# EAGLE design FPGA_board-v1 (EAGLE 9.1.3)
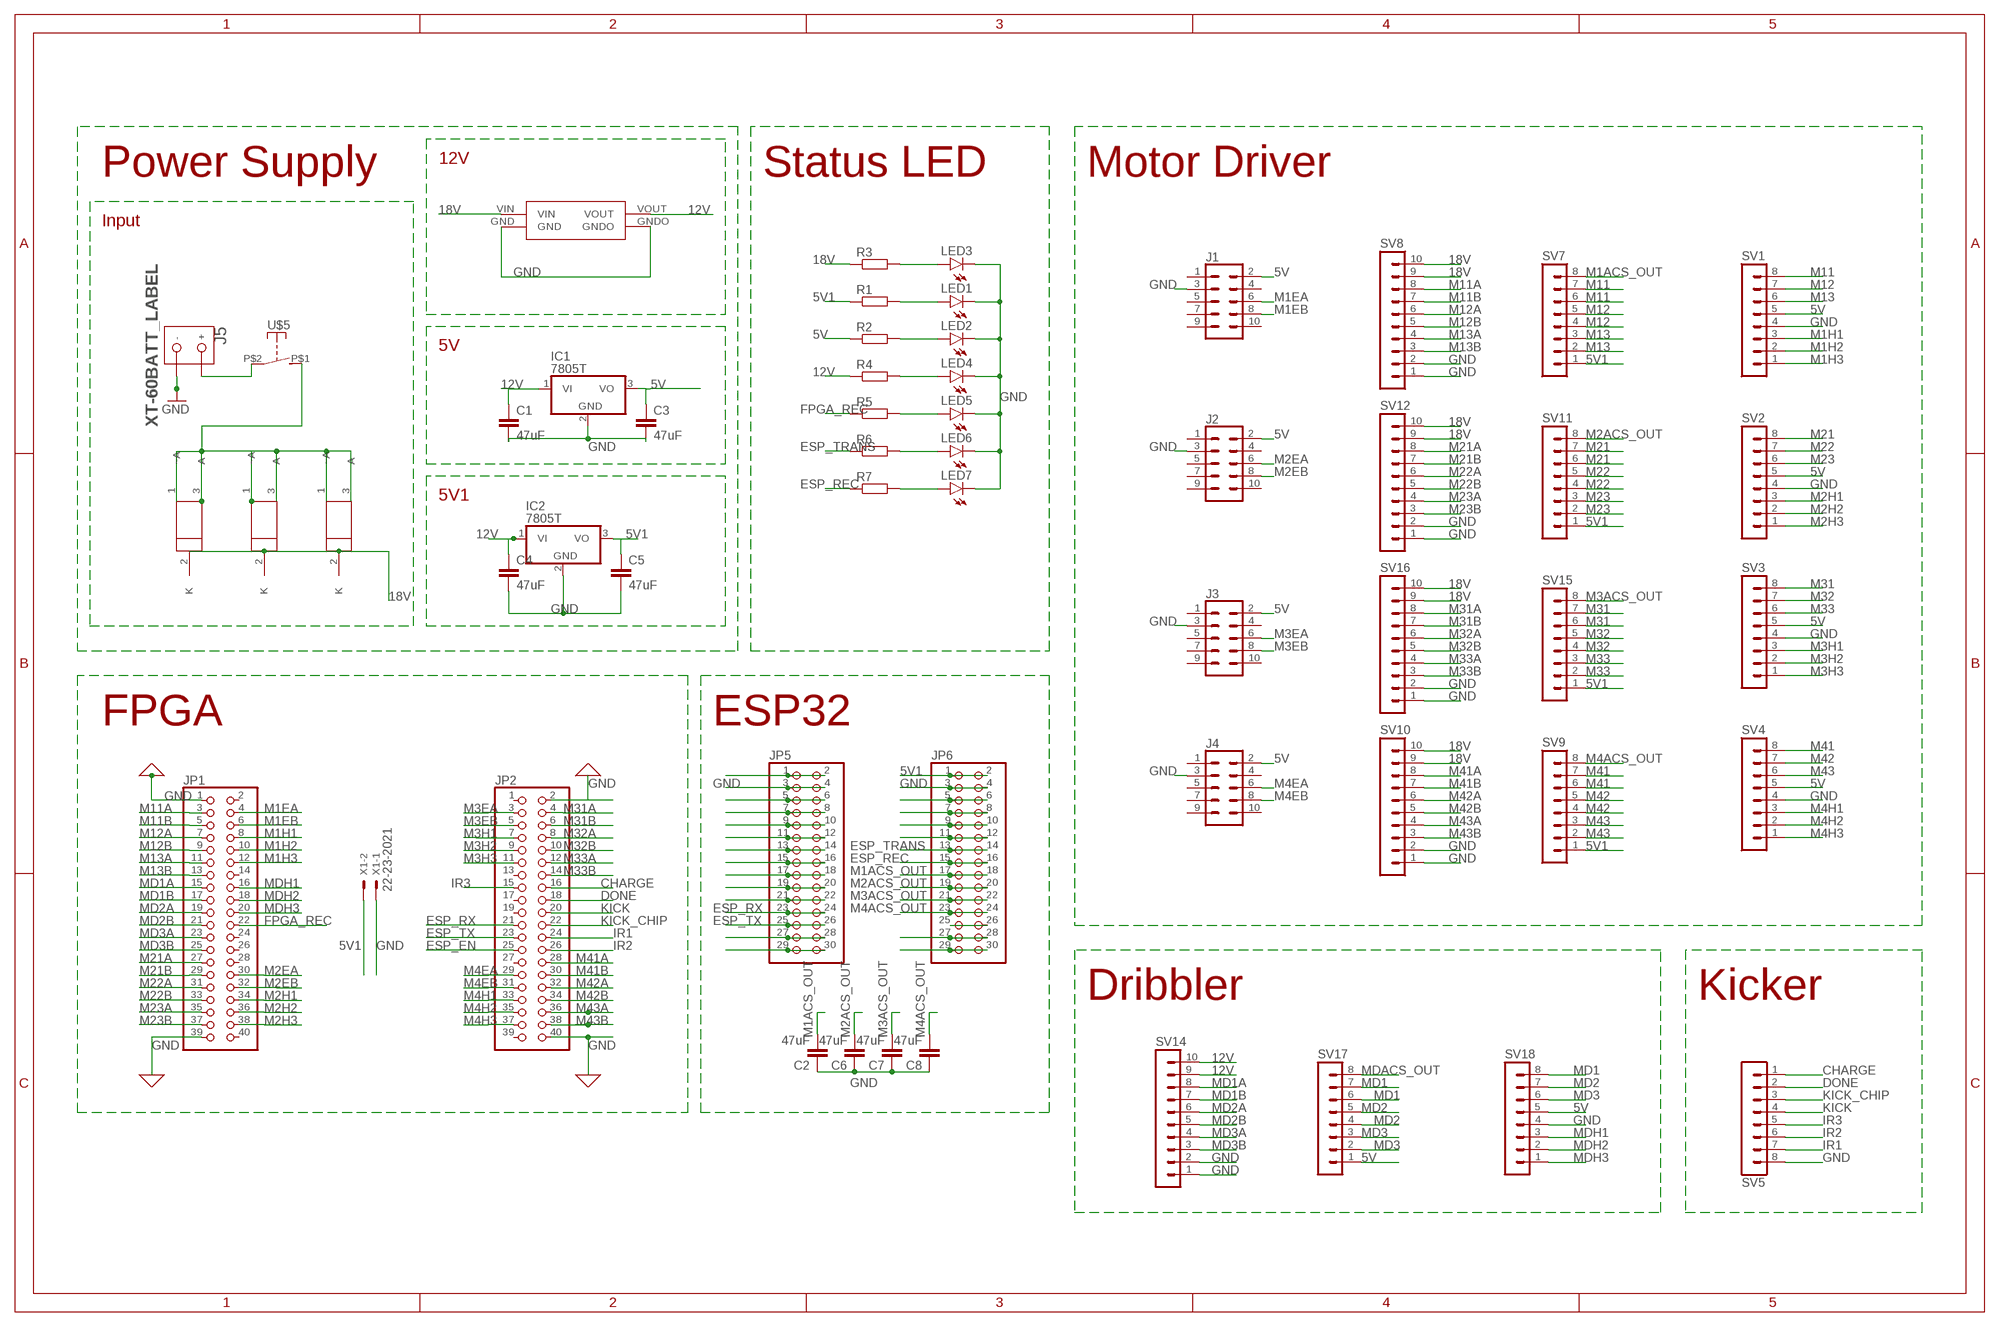
[diagram p0: schematic, sheet 1]

## Parts
C1  47uF  C-EUC1206  [C1206]
C2  47uF  C-EUC1206  [C1206]
C3  47uF  C-EUC1206  [C1206]
C4  47uF  C-EUC1206  [C1206]
C5  47uF  C-EUC1206  [C1206]
C6  47uF  C-EUC1206  [C1206]
C7  47uF  C-EUC1206  [C1206]
C8  47uF  C-EUC1206  [C1206]
IC1  7805T  [TO220H]
IC2  7805T  [TO220H]
J1  CONN_05X2SHD_LOCK  [2X5-SHROUDED_LOCK]
J2  CONN_05X2SHD_LOCK  [2X5-SHROUDED_LOCK]
J3  CONN_05X2SHD_LOCK  [2X5-SHROUDED_LOCK]
J4  CONN_05X2SHD_LOCK  [2X5-SHROUDED_LOCK]
J5  XT-60BATT_LABEL  [XT-60]
JP1  PINHD-2X20  [2X20]
JP2  PINHD-2X20  [2X20]
JP5  PINHD-2X15  [2X15]
JP6  PINHD-2X15  [2X15]
LED1  LEDSMT1206  [1206]
LED2  LEDSMT1206  [1206]
LED3  LEDSMT1206  [1206]
LED4  LEDSMT1206  [1206]
LED5  LEDSMT1206  [1206]
LED6  LEDSMT1206  [1206]
LED7  LEDSMT1206  [1206]
R1  R-EU_R1206  [R1206]
R2  R-EU_R1206  [R1206]
R3  R-EU_R1206  [R1206]
R4  R-EU_R1206  [R1206]
R5  R-EU_R1206  [R1206]
R6  R-EU_R1206  [R1206]
R7  R-EU_R1206  [R1206]
SV1  MA08-1  [MA08-1]
SV2  MA08-1  [MA08-1]
SV3  MA08-1  [MA08-1]
SV4  MA08-1  [MA08-1]
SV5  MA08-1  [MA08-1]
SV7  MA08-1  [MA08-1]
SV8  MA10-1  [MA10-1]
SV9  MA08-1  [MA08-1]
SV10  MA10-1  [MA10-1]
SV11  MA08-1  [MA08-1]
SV12  MA10-1  [MA10-1]
SV14  MA10-1  [MA10-1]
SV15  MA08-1  [MA08-1]
SV16  MA10-1  [MA10-1]
SV17  MA08-1  [MA08-1]
SV18  MA08-1  [MA08-1]
U1  LP38690DT-3.3  [TO228P1042X238-3N]
U2  LP38690DT-3.3  [TO228P1042X238-3N]
U3  LP38690DT-3.3  [TO228P1042X238-3N]
U$4  BUCK  [BUCK]
U$5  SWITCH_DA10  [DA10]
X1  22-23-2021  [22-23-2021]

## Nets
5V [5v]: C3.1 IC1.3(VO) J1.2 J2.2 J3.2 J4.2 R2.1 SV1.5 SV2.5 SV3.5 SV4.5 SV17.1 SV18.5
5V1 [5v]: C5.1 IC2.3(VO) JP6.1 JP6.2 R1.1 SV7.1 SV9.1 SV11.1 SV15.1 X1.2
12V [18V]: C1.1 C4.1 IC1.1(VI) IC2.1(VI) R4.1 SV14.9 SV14.10 U$4.VOUT
18V [18V]: R3.1 SV8.9 SV8.10 SV10.9 SV10.10 SV12.9 SV12.10 SV16.9 SV16.10 U1.2(K) U2.2(K) U3.2(K) U$4.VIN
CHARGE: JP2.16 SV5.1
DONE: JP2.18 SV5.2
ESP_EN: JP2.25
ESP_REC: JP6.15 JP6.16 R7.1
ESP_RX: JP2.21 JP5.23 JP5.24
ESP_TRANS: JP6.13 JP6.14 R6.1
ESP_TX: JP2.23 JP5.25 JP5.26
FPGA_REC: JP1.22 R5.1
GND [gnd]: C1.2 C2.1 C3.2 C4.2 C5.2 C6.1 C7.1 C8.1 IC1.2(GND) IC2.2(GND) J1.3 J2.3 J3.3 J4.3 J5.GND(-) JP1.1 JP1.39 JP2.2 JP2.40 JP5.3 JP5.4 JP6.3 JP6.4 LED1.C LED2.C LED3.C LED4.C LED5.C LED6.C LED7.C SV1.4 SV2.4 SV3.4 SV4.4 SV5.8 SV8.1 SV8.2 SV10.1 SV10.2 SV12.1 SV12.2 SV14.1 SV14.2 SV16.1 SV16.2 SV18.4 U$4.GND U$4.GNDO X1.1
INPUT [VCKT]: U1.1(~A) U1.3(A) U2.1(~A) U2.3(A) U3.1(~A) U3.3(A) U$5.P$1(S)
IR1: JP2.24 SV5.7
IR2: JP2.26 SV5.6
IR3 [signal]: JP2.15 SV5.5
KICK: JP2.20 SV5.4
KICK_CHIP: JP2.22 SV5.3
M1ACS_OUT: C2.2 JP6.17 JP6.18 SV7.8
M1EA: J1.6 JP1.4
M1EB: J1.8 JP1.6
M1H1: JP1.8 SV1.3
M1H2: JP1.10 SV1.2
M1H3: JP1.12 SV1.1
M2ACS_OUT: C6.2 JP6.19 JP6.20 SV11.8
M2EA: J2.6 JP1.30
M2EB: J2.8 JP1.32
M2H1: JP1.34 SV2.3
M2H2: JP1.36 SV2.2
M2H3: JP1.38 SV2.1
M3ACS_OUT: C7.2 JP6.21 JP6.22 SV15.8
M3EA: J3.6 JP2.3
M3EB: J3.8 JP2.5
M3H1: JP2.7 SV3.3
M3H2: JP2.9 SV3.2
M3H3: JP2.11 SV3.1
M4ACS_OUT: C8.2 JP6.23 JP6.24 SV9.8
M4EA: J4.6 JP2.29
M4EB: J4.8 JP2.31
M4H1: JP2.33 SV4.3
M4H2: JP2.35 SV4.2
M4H3: JP2.37 SV4.1
M11 [motor]: SV1.8 SV7.6 SV7.7
M11A [signal]: JP1.3 SV8.8
M11B [signal]: JP1.5 SV8.7
M12 [motor]: SV1.7 SV7.4 SV7.5
M12A: JP1.7 SV8.6
M12B: JP1.9 SV8.5
M13 [motor]: SV1.6 SV7.2 SV7.3
M13A: JP1.11 SV8.4
M13B: JP1.13 SV8.3
M21 [motor]: SV2.8 SV11.6 SV11.7
M21A: JP1.27 SV12.8
M21B: JP1.29 SV12.7
M22 [motor]: SV2.7 SV11.4 SV11.5
M22A: JP1.31 SV12.6
M22B: JP1.33 SV12.5
M23 [motor]: SV2.6 SV11.2 SV11.3
M23A: JP1.35 SV12.4
M23B: JP1.37 SV12.3
M31 [motor]: SV3.8 SV15.6 SV15.7
M31A: JP2.4 SV16.8
M31B: JP2.6 SV16.7
M32 [motor]: SV3.7 SV15.4 SV15.5
M32A: JP2.8 SV16.6
M32B: JP2.10 SV16.5
M33 [motor]: SV3.6 SV15.2 SV15.3
M33A: JP2.12 SV16.4
M33B: JP2.14 SV16.3
M41 [motor]: SV4.8 SV9.6 SV9.7
M41A: JP2.28 SV10.8
M41B: JP2.30 SV10.7
M42 [motor]: SV4.7 SV9.4 SV9.5
M42A: JP2.32 SV10.6
M42B: JP2.34 SV10.5
M43 [motor]: SV4.6 SV9.2 SV9.3
M43A: JP2.36 SV10.4
M43B: JP2.38 SV10.3
MD1 [motor]: SV17.6 SV17.7 SV18.8
MD1A: JP1.15 SV14.8
MD1B: JP1.17 SV14.7
MD2 [motor]: SV17.4 SV17.5 SV18.7
MD2A: JP1.19 SV14.6
MD2B: JP1.21 SV14.5
MD3 [motor]: SV17.2 SV17.3 SV18.6
MD3A: JP1.23 SV14.4
MD3B: JP1.25 SV14.3
MDACS_OUT: SV17.8
MDH1: JP1.16 SV18.3
MDH2: JP1.18 SV18.2
MDH3: JP1.20 SV18.1
N$1: JP5.1 JP5.2
N$4: LED1.A R1.2
N$6: JP5.5 JP5.6
N$7: LED2.A R2.2
N$8: JP5.7 JP5.8
N$9: JP5.9 JP5.10
N$10: LED3.A R3.2
N$11: JP5.11 JP5.12
N$12: JP5.13 JP5.14
N$13: LED4.A R4.2
N$14: JP5.15 JP5.16
N$15: JP5.17 JP5.18
N$16: LED5.A R5.2
N$17: JP5.19 JP5.20
N$18: JP5.21 JP5.22
N$19: LED6.A R6.2
N$22: LED7.A R7.2
N$23: JP5.27 JP5.28
N$24: JP5.29 JP5.30
N$27: JP6.5 JP6.6
N$28: JP6.7 JP6.8
N$29: JP6.9 JP6.10
N$30: JP6.11 JP6.12
N$38: JP6.27 JP6.28
N$39: JP6.29 JP6.30
N$41: JP6.25 JP6.26
SUPP [VCKT]: J5.BATT(+) U$5.P$2(P)
Unconnected: J1.1 J1.4 J1.5 J1.7 J1.9 J1.10 J2.1 J2.4 J2.5 J2.7 J2.9 J2.10 J3.1 J3.4 J3.5 J3.7 J3.9 J3.10 J4.1 J4.4 J4.5 J4.7 J4.9 J4.10 JP1.2 JP1.14 JP1.24 JP1.26 JP1.28 JP1.40 JP2.1 JP2.13 JP2.17 JP2.19 JP2.27 JP2.39

## Notes on the sheet
- 12V
- Power Supply | Status LED | Motor Driver
- Input
- 5V
- 5V1
- FPGA | ESP32
- Dribbler | Kicker

## Library data of the parts
C1-C8 = rcl:C-EU: CAPACITOR, European symbol
IC1 IC2 = linear:78*: Positive VOLTAGE REGULATOR Source: http://cache.national.com/ds/LM/LM78L05.pdf http://www.fairchildsemi.com/ds/LM/LM7805.pdf
J1-J4 = SparkFun-Connectors:CONN_05X2: Multi connection point. Often used as Generic Header-pin footprint for 0.1 inch spaced/style header connections For AVR SPI programming port, see special device with nice symbol: "AVR_SPI_PROG_5x2.dev" You can populate with any combo of single row headers, but if you'd like an exact match, check these: 2x5 AVR ICSP Male Header <https://www.sparkfun.com/products/778> (PRT-00778) 2x5 Pin Shrouded Header <https://www.sparkfun.com/products/8506> (PRT-08506) On any of the 0.1 inch spaced packages, you can populate with these: Break Away Headers - Straight <https://www.sparkfun.com/products/116> (PRT-00116) Break Away Male Headers - Right Angle <https://www.sparkfun.com/products/553> (PRT-00553) Female Headers <https://www.sparkfun.com/products/115> (PRT-00115) Break Away Headers - Machine Pin <https://www.sparkfun.com/products/117> (PRT-00117) Break Away Female Headers - Swiss Machine Pin <https://www.sparkfun.com/products/743> (PRT-00743) Special note: the shrouded connector mates well with our 5x2 ribbon cables: 2x5 Pin IDC Ribbon Cable <https://www.sparkfun.com/products/8535> (PRT-08535); PROD_ID: CONN-08671; SF_ID: PRT-08506
J5 = RoboJackets-Connectors:XT-60: XT-60 Power Connector Distributor: HobbyKing <http://www.hobbyking.com/hobbyking/store/RC_PRODUCT_SEARCH.asp?strSearch=xt-60>
JP1 JP2 = pinhead:PINHD-2X20: PIN HEADER
JP5 JP6 = pinhead:PINHD-2X15: PIN HEADER
LED1-LED7 = led:LED: LED OSRAM: - CHIPLED LG R971, LG N971, LY N971, LG Q971, LY Q971, LO R971, LY R971 LH N974, LH R974 LS Q976, LO Q976, LY Q976 LO Q996 - Hyper CHIPLED LW Q18S LB Q993, LB Q99A, LB R99A - SideLED LS A670, LO A670, LY A670, LG A670, LP A670 LB A673, LV A673, LT A673, LW A673 LH A674 LY A675 LS A676, LA A676, LO A676, LY A676, LW A676 LS A679, LY A679, LG A679 - Hyper Micro SIDELED® LS Y876, LA Y876, LO Y876, LY Y876 LT Y87S - SmartLED LW L88C, LW L88S LB L89C, LB L89S, LG L890 LS L89K, LO L89K, LY L89K LS L896, LA L896, LO L896, LY L896 - TOPLED LS T670, LO T670, LY T670, LG T670, LP T670 LSG T670, LSP T670, LSY T670, LOP T670, LYG T670 LG T671, LOG T671, LSG T671 LB T673, LV T673, LT T673, LW T673 LH T674 LS T676, LA T676, LO T676, LY T676, LB T676, LH T676, LSB T676, LW T676 LB T67C, LV T67C, LT T67C, LS T67K, LO T67K, LY T67K, LW E67C LS E67B, LA E67B, LO E67B, LY E67B, LB E67C, LV E67C, LT E67C LW T67C LS T679, LY T679, LG T679 LS T770, LO T770, LY T770, LG T770, LP T770 LB T773, LV T773, LT T773, LW T773 LH T774 LS E675, LA E675, LY E675, LS T675 LS T776, LA T776, LO T776, LY T776, LB T776 LHGB T686 LT T68C, LB T68C - Hyper Mini TOPLED® LB M676 - Mini TOPLED Santana® LG M470 LS M47K, LO M47K, LY M47K Source: http://www.osram.convergy.de LUXEON: - LUMILED® LXK2-PW12-R00, LXK2-PW12-S00, LXK2-PW14-U00, LXK2-PW14-V00 LXK2-PM12-R00, LXK2-PM12-S00, LXK2-PM14-U00 LXK2-PE12-Q00, LXK2-PE12-R00, LXK2-PE12-S00, LXK2-PE14-T00, LXK2-PE14-U00 LXK2-PB12-K00, LXK2-PB12-L00, LXK2-PB12-M00, LXK2-PB14-N00, LXK2-PB14-P00, LXK2-PB14-Q00 LXK2-PR12-L00, LXK2-PR12-M00, LXK2-PR14-Q00, LXK2-PR14-R00 LXK2-PD12-Q00, LXK2-PD12-R00, LXK2-PD12-S00 LXK2-PH12-R00, LXK2-PH12-S00 LXK2-PL12-P00, LXK2-PL12-Q00, LXK2-PL12-R00 Source: www.luxeon.com KINGBRIGHT: KA-3528ASYC Source: www.kingbright.com
R1-R7 = resistor:R-EU_: RESISTOR, European symbol
SV1-SV5 SV7 SV9 SV11 SV15 SV17 SV18 = con-lstb:MA08-1: PIN HEADER; OC_FARNELL: unknown; OC_NEWARK: unknown
SV8 SV10 SV12 SV14 SV16 = con-lstb:MA10-1: PIN HEADER; OC_FARNELL: unknown; OC_NEWARK: unknown
U1-U3 = LP38690DT-3.3:LP38690DT-3.3; MPN: LP38690DT-3.3; OC_FARNELL: 1008048; OC_NEWARK: 41K7439; PACKAGE: TO-252; SUPPLIER: National Semiconductor
U$4 = BUCK:BUCK
U$5 = switch_DA10:SWITCH_DA10
X1 = con-molex:22-23-2021: .100" (2.54mm) Center Header - 2 Pin; MF: MOLEX; MPN: 22-23-2021; OC_FARNELL: 1462926; OC_NEWARK: 25C3832

## Net classes
0 signal1: width 0.3 mm, drill 0.4 mm, clearance 0.2 mm
1 5v: width 0.4 mm, drill 0.4 mm, clearance 0.2 mm
2 18V: width 1.2 mm, drill 1.3 mm, clearance 0.2 mm
3 signal: width 0.3 mm, drill 0.4 mm, clearance 0.2 mm
4 gnd: width 0.3 mm, drill 0.4 mm, clearance 0.2 mm
5 VCKT: width 4 mm, drill 4 mm, clearance 0.2 mm
6 motor: width 0.8 mm, drill 1 mm, clearance 0.2 mm

## Board
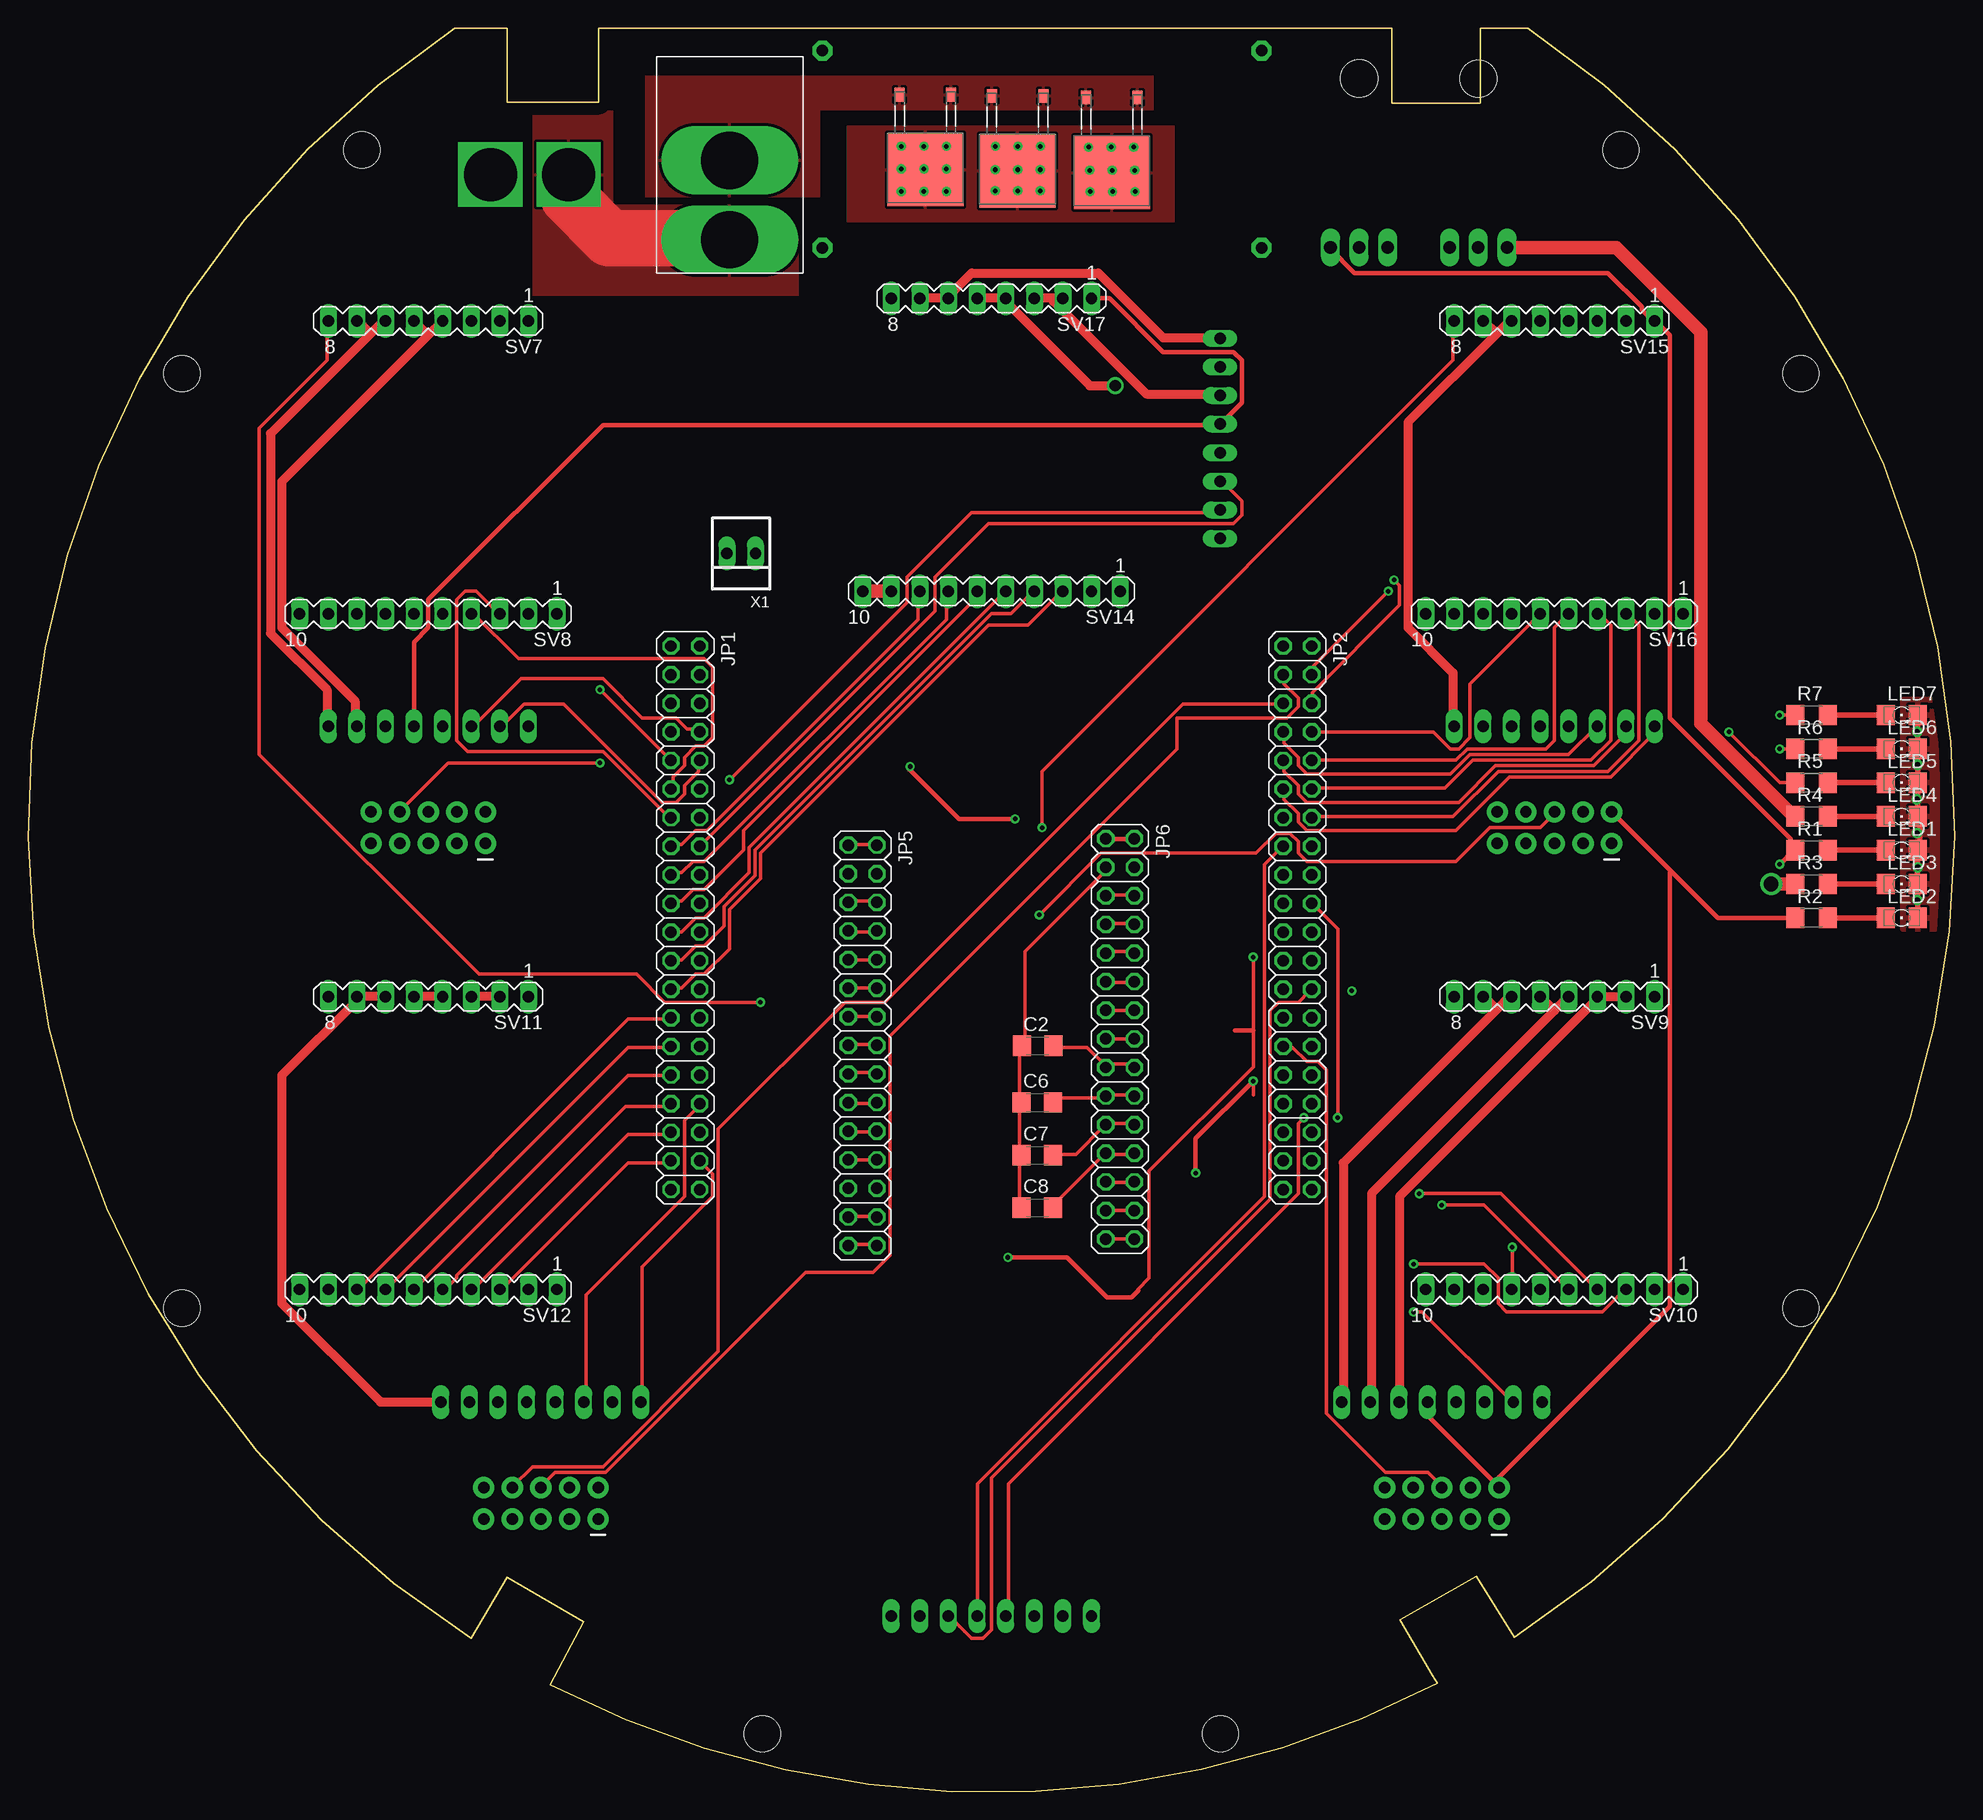
[diagram p1: board, top side]
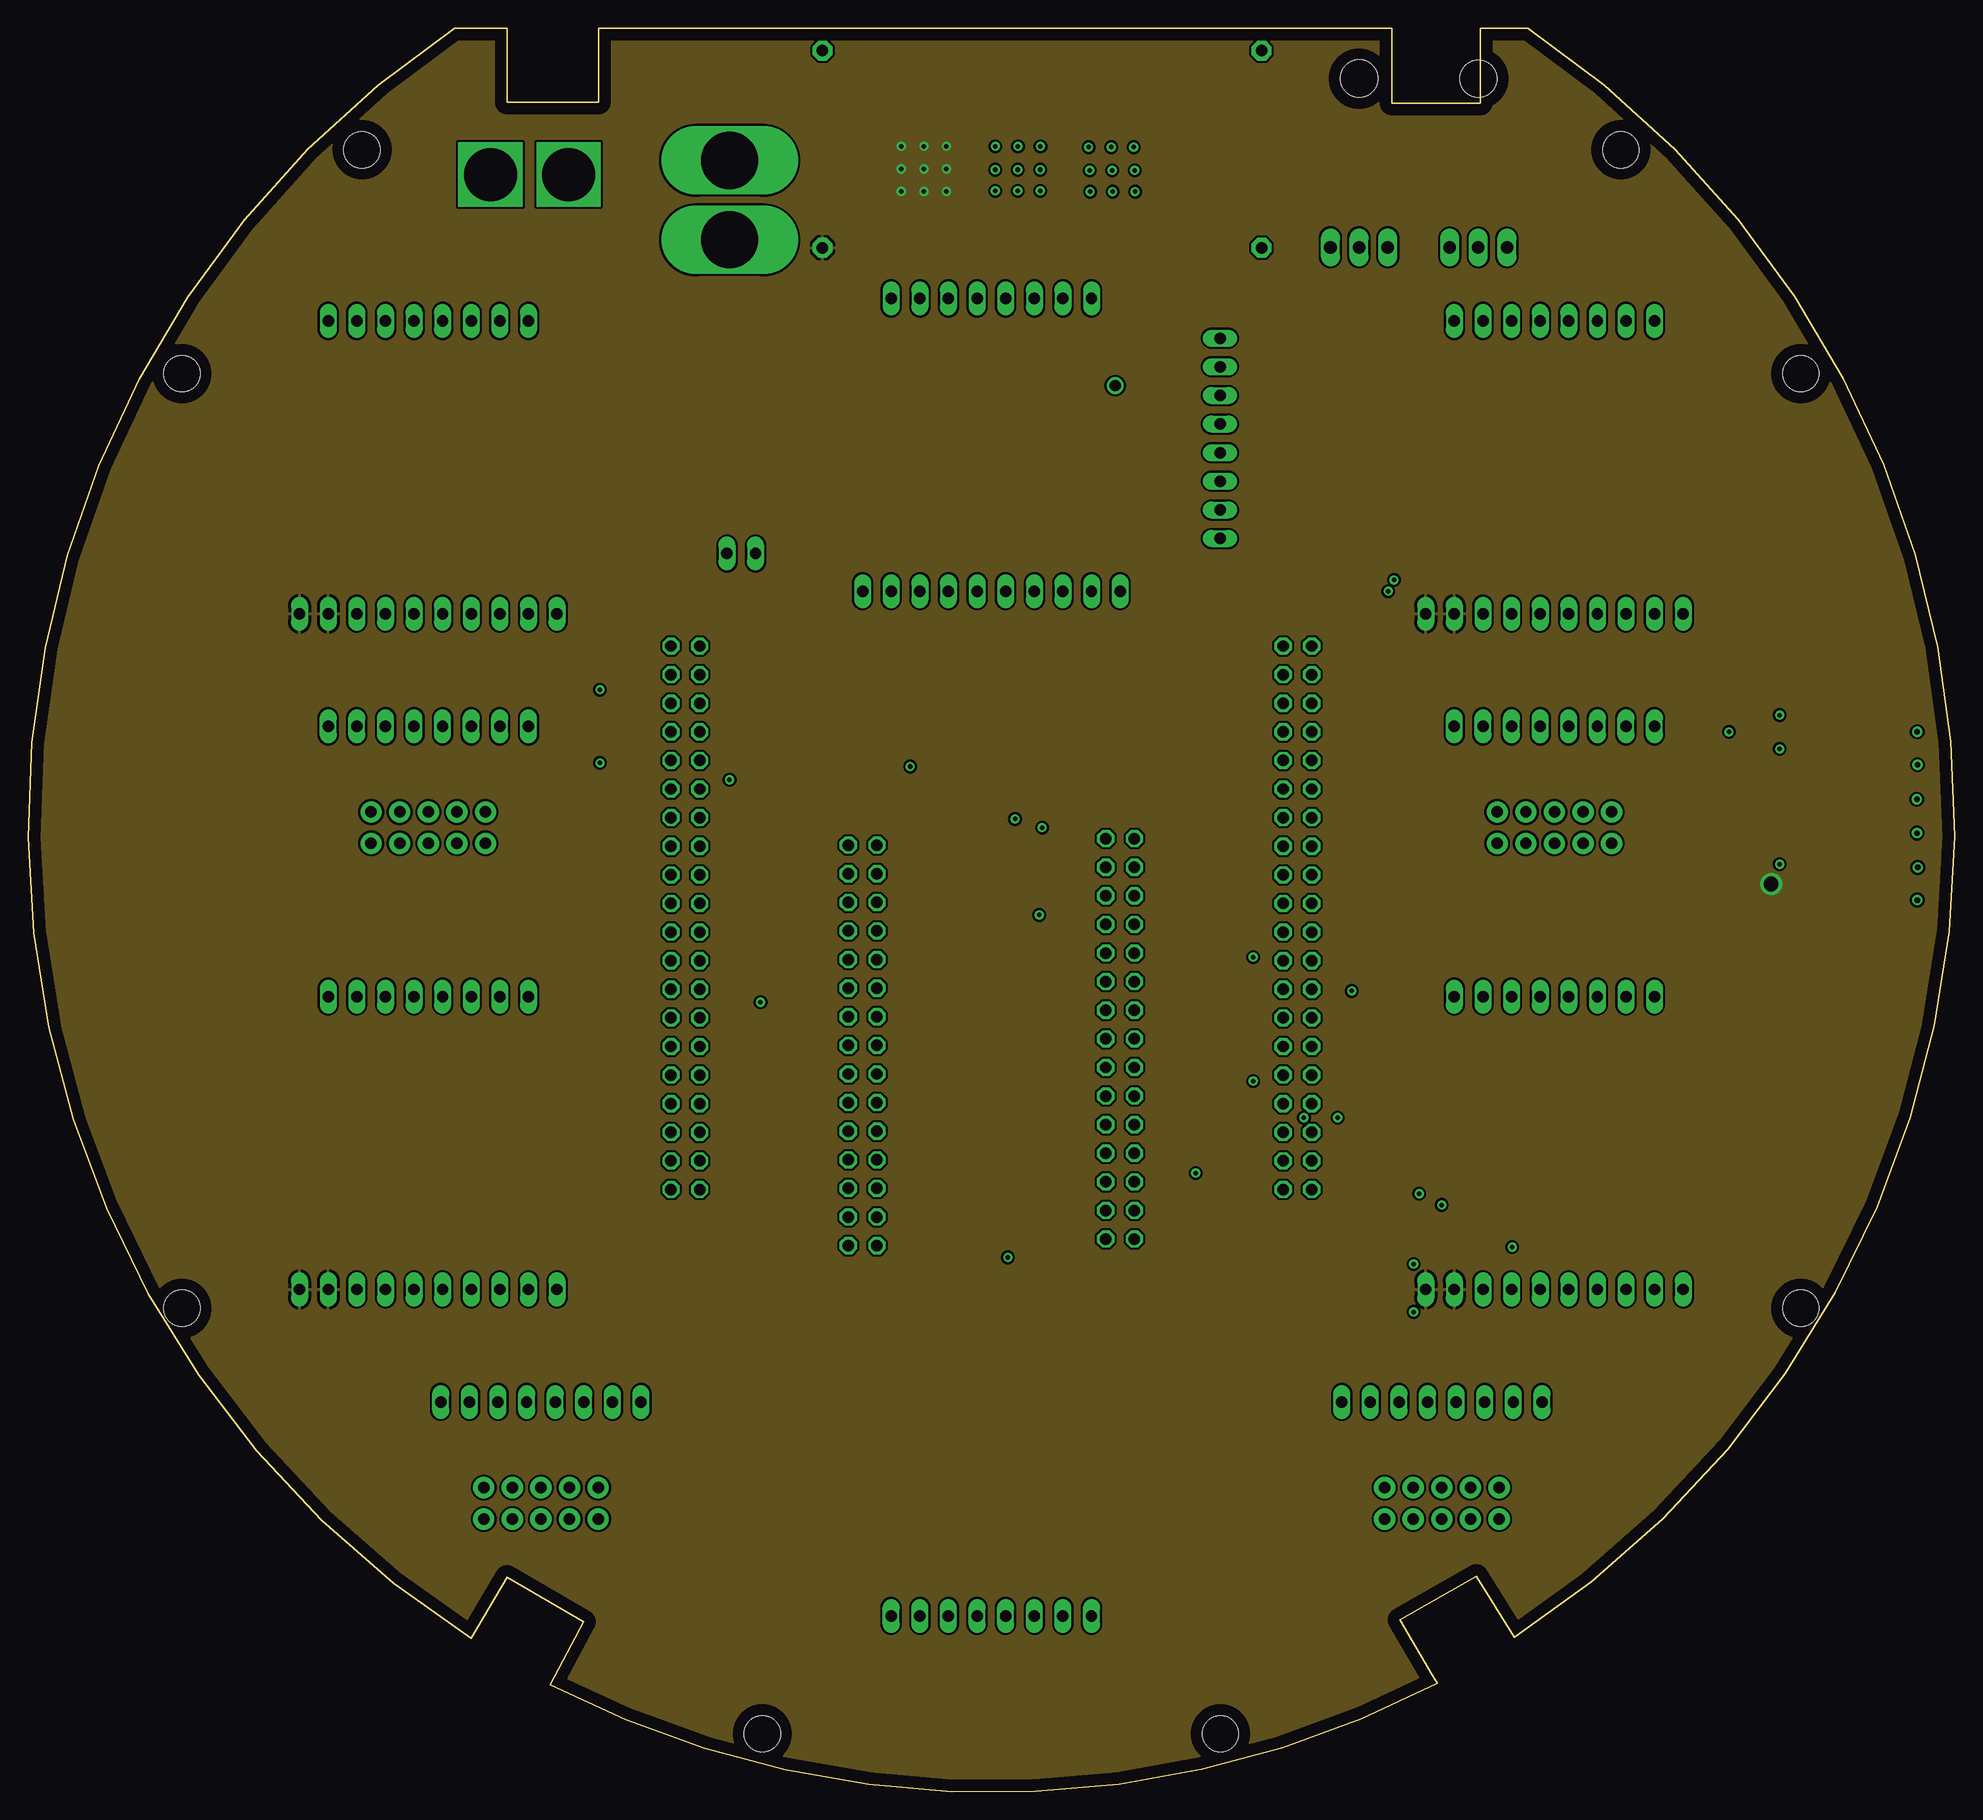
[diagram p2: board, inner layer Route2]
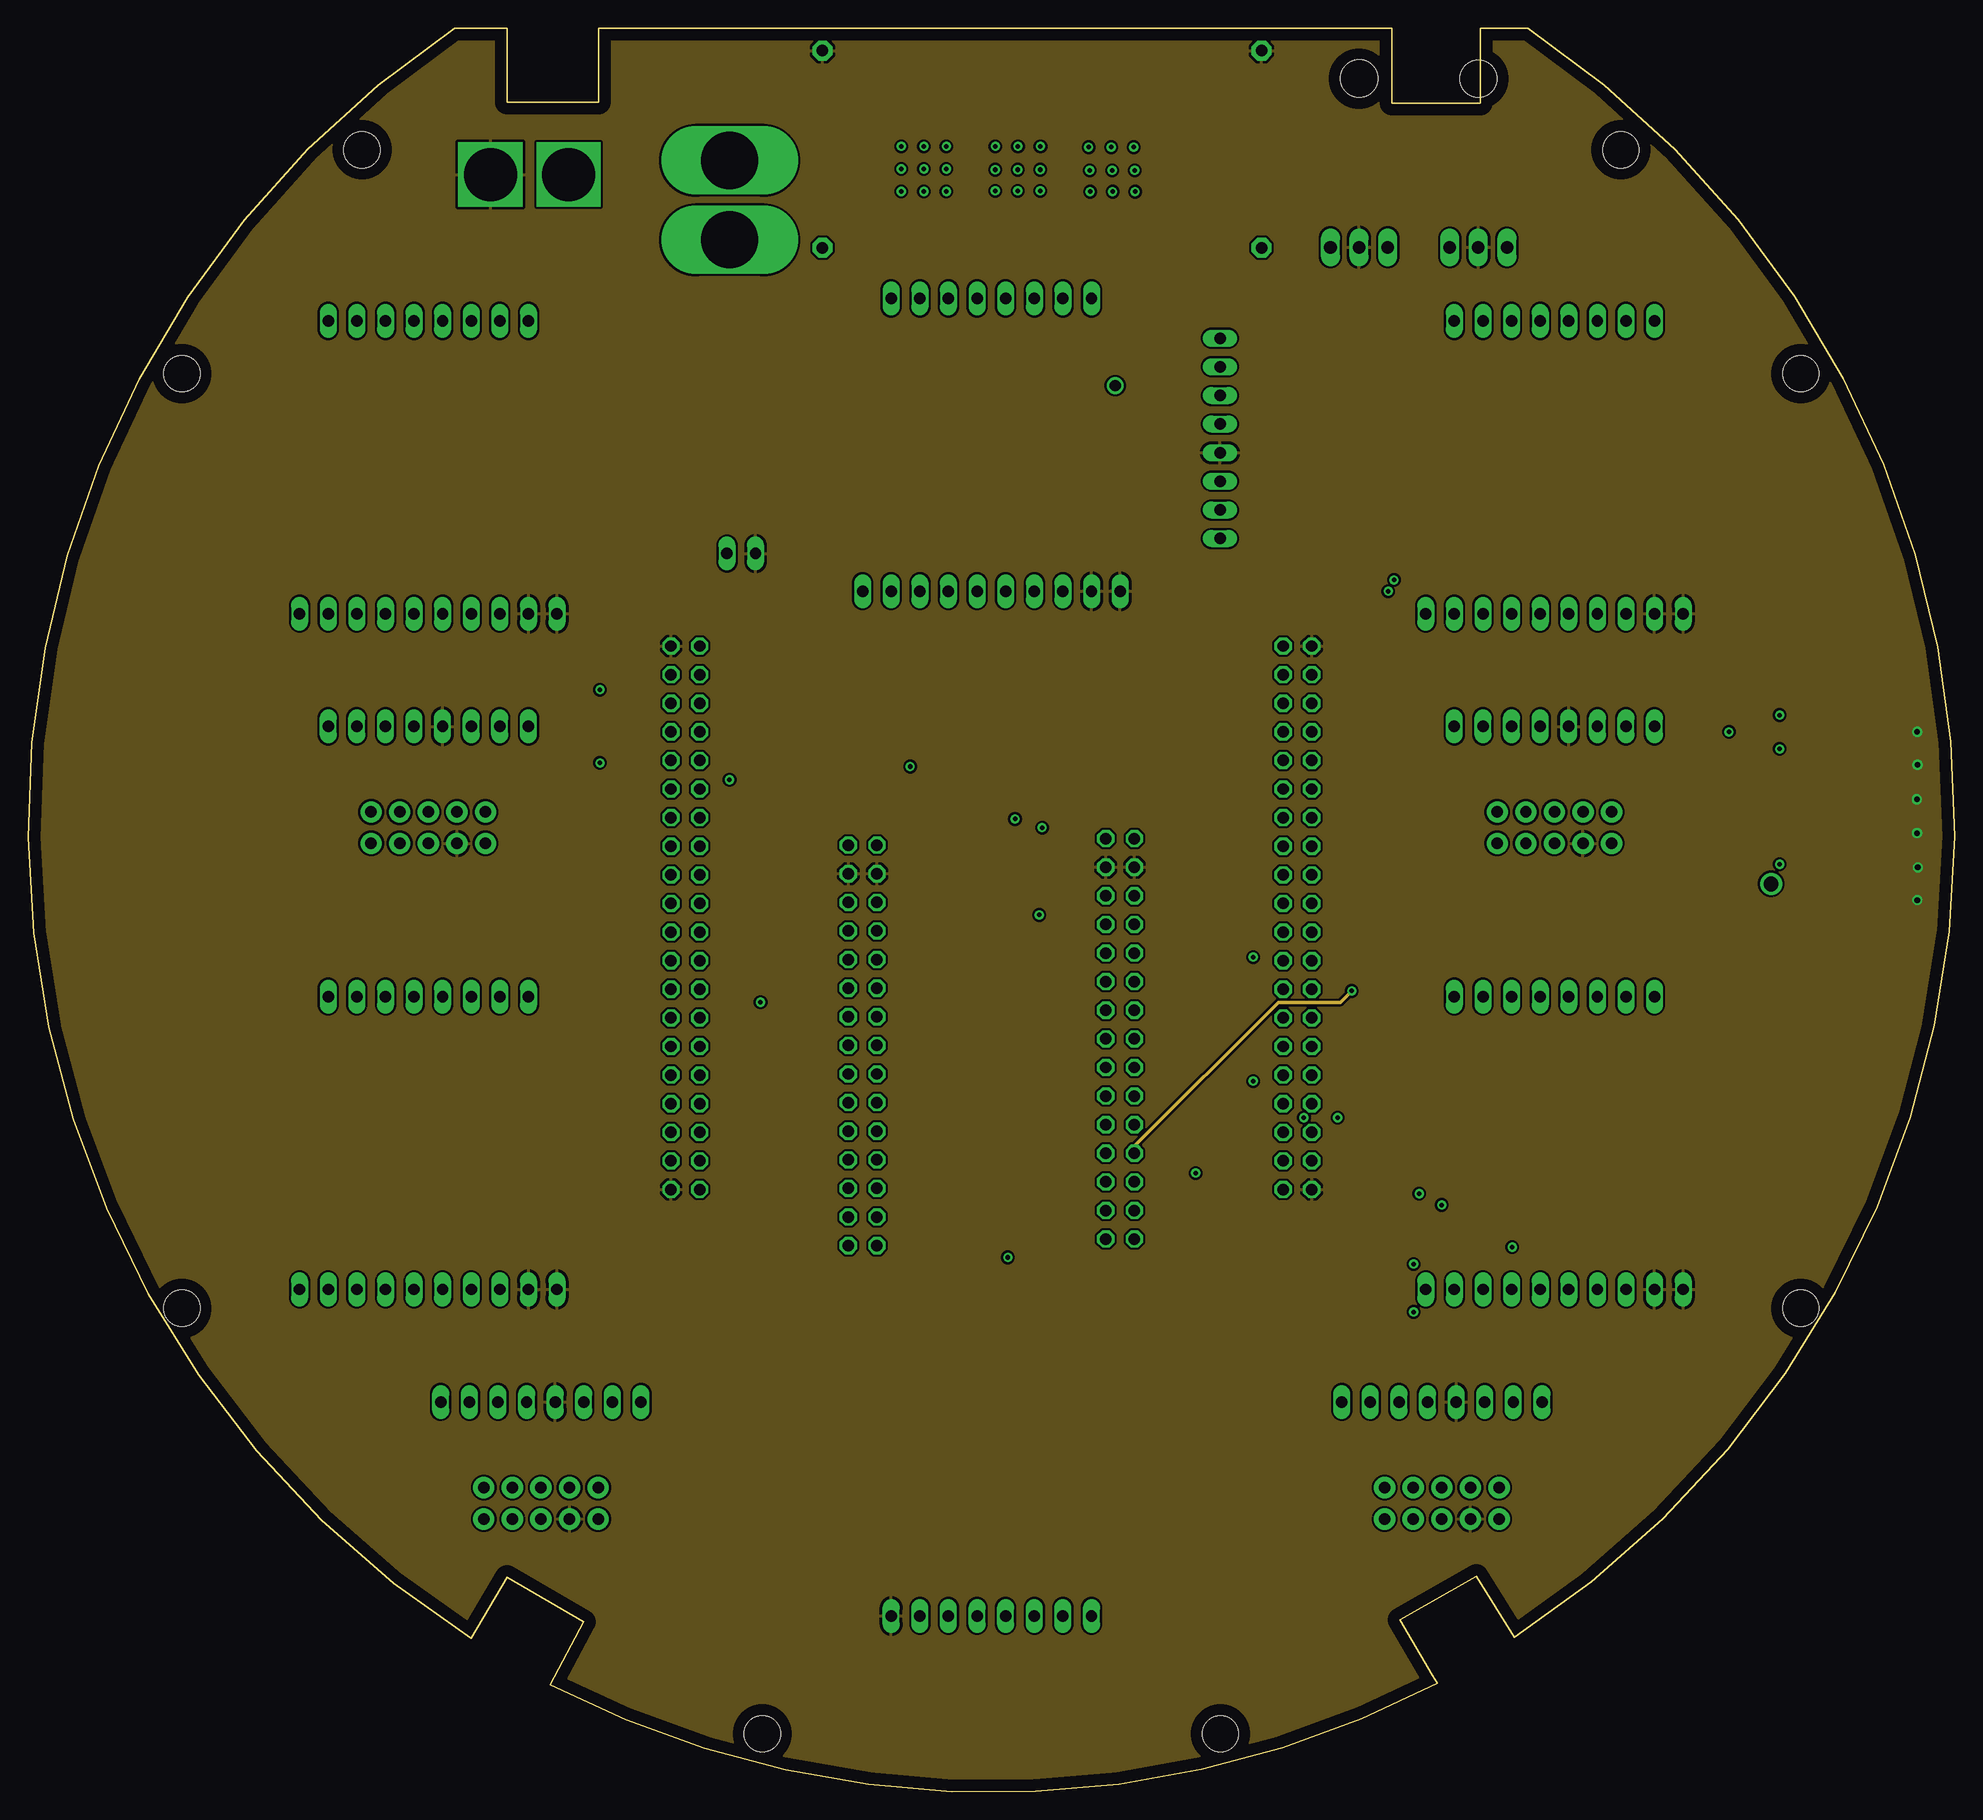
[diagram p3: board, inner layer Route15]
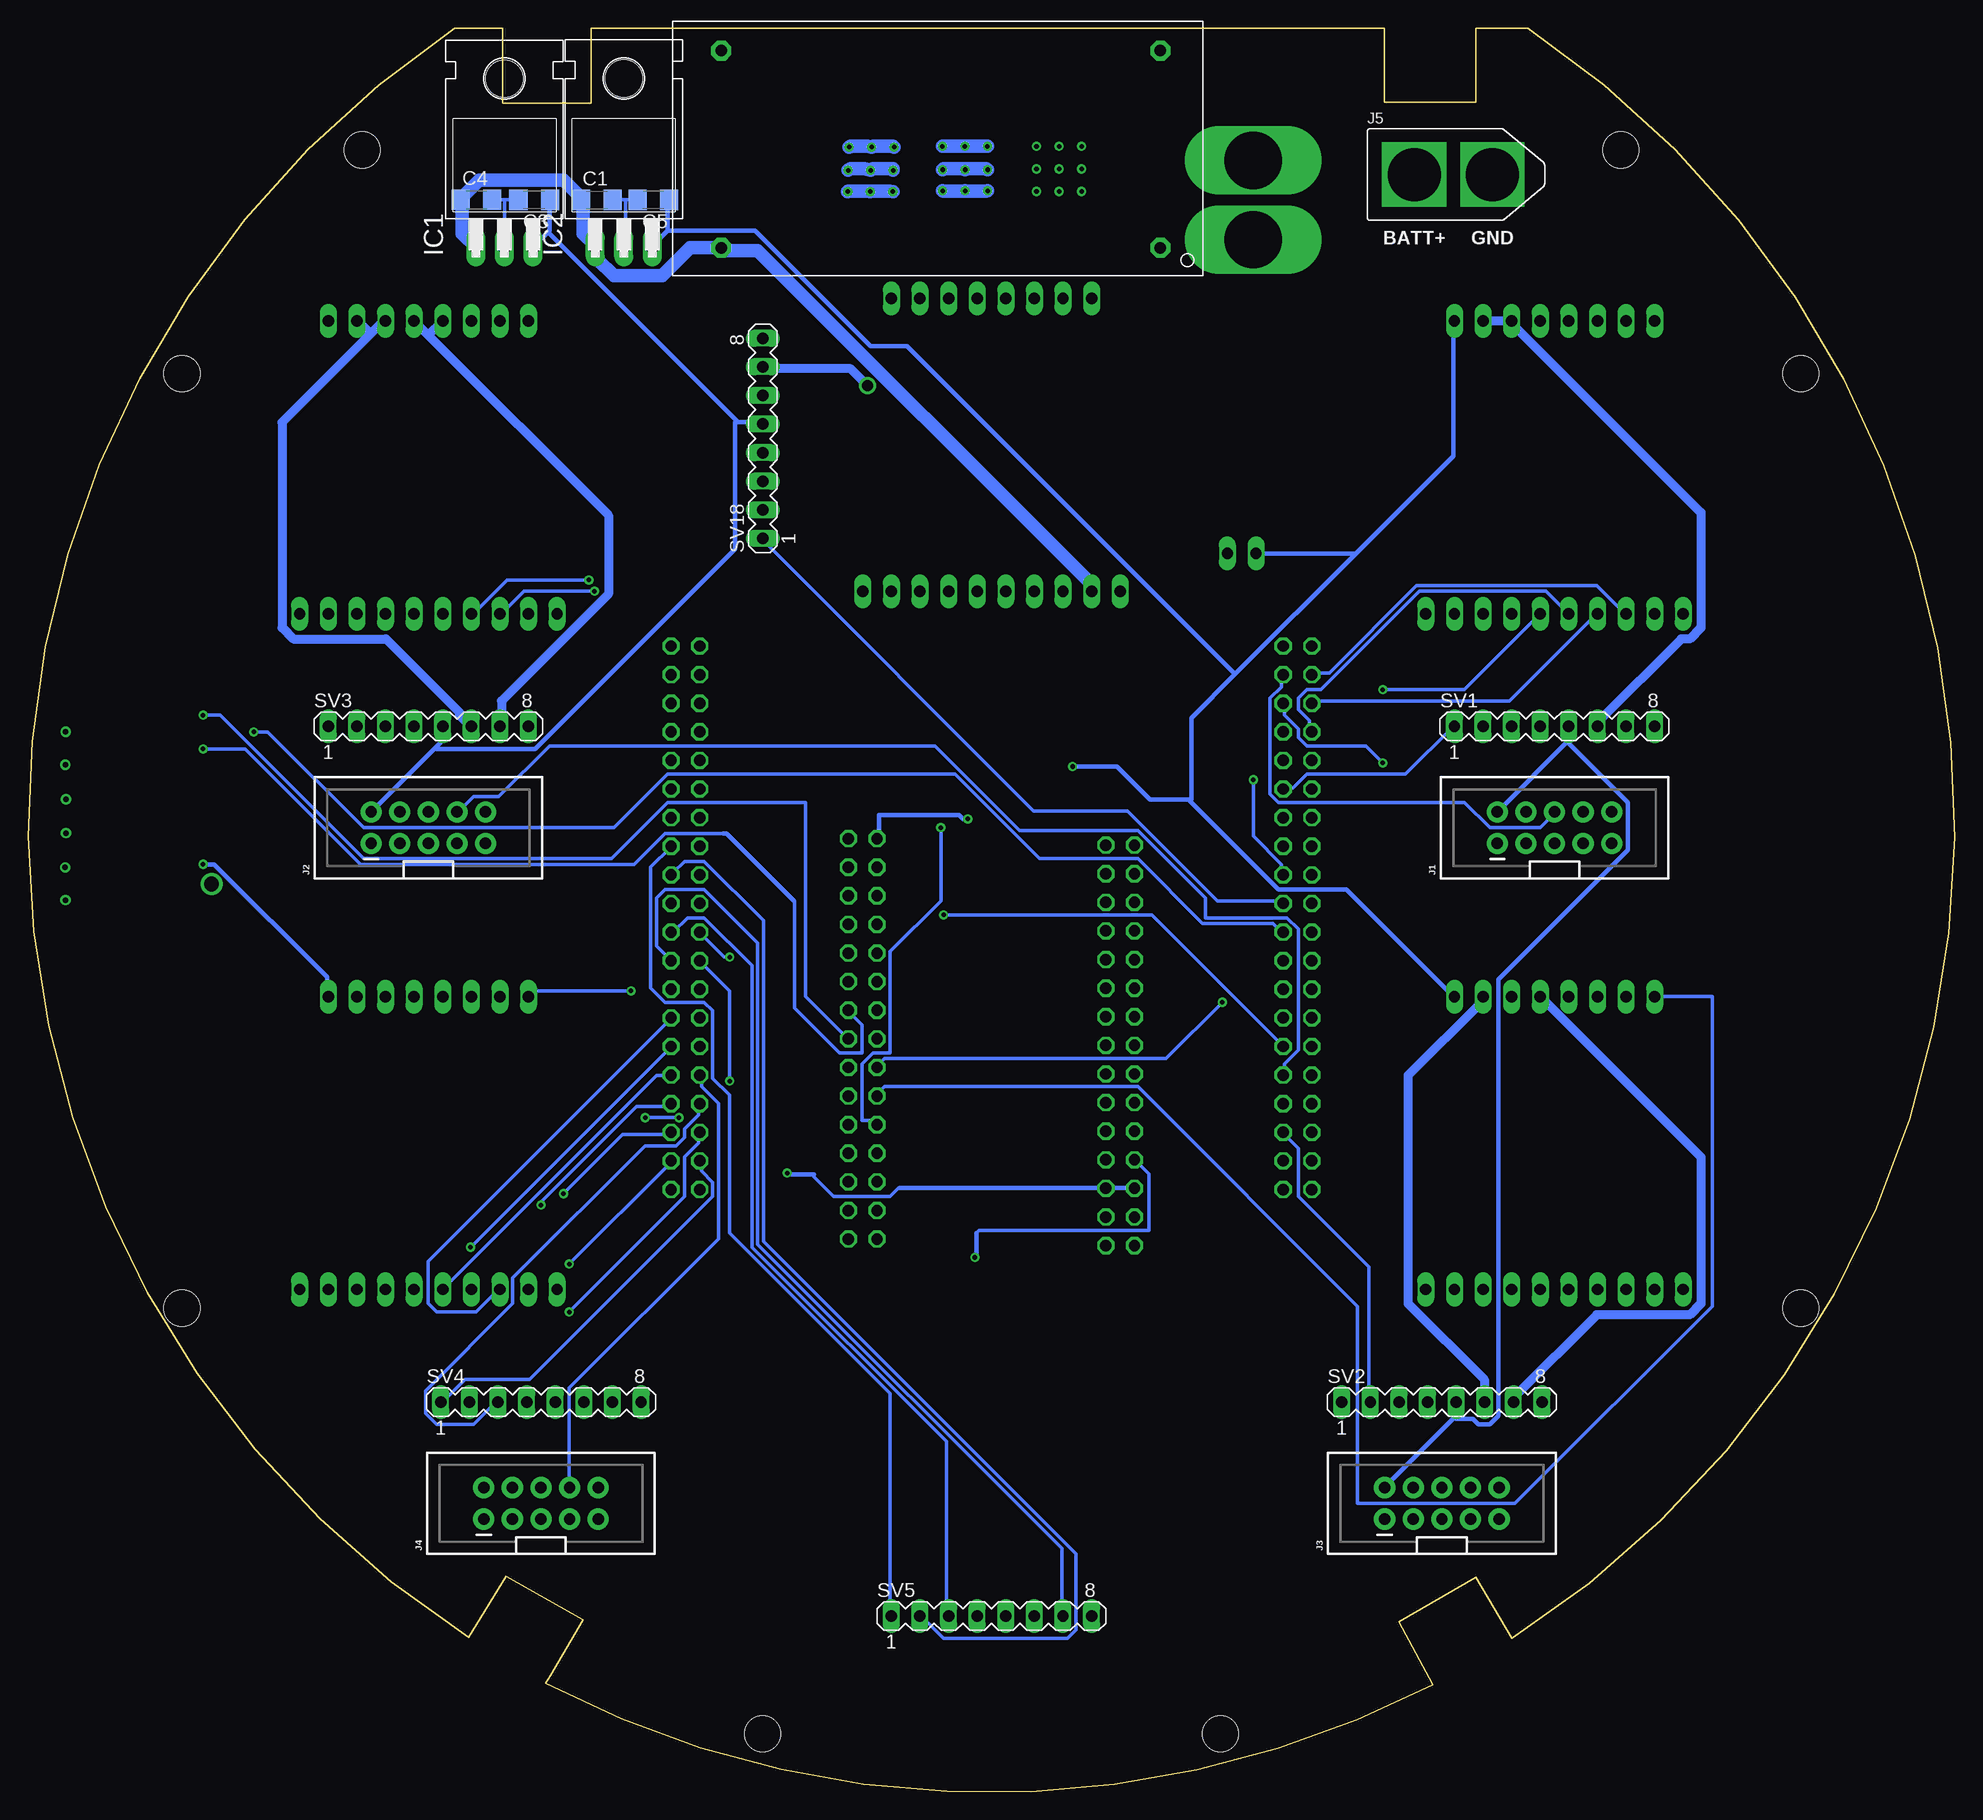
[diagram p4: board, bottom side, seen from below]

Size 171.07 x 156.59 mm. Coordinates in mm from the lower left corner, seen from the top.
Outline: 133.18,156.59 128.95,156.59
Outline: 121.08,156.59 50.64,156.59
Outline: 42.52,156.59 37.88,156.59
Outline: 37.88,156.59 42.52,156.59
Outline: 50.64,156.59 121.08,156.59
Outline: 128.95,156.59 133.18,156.59
Outline: 133.18,156.59 128.95,156.59
Outline: 121.08,156.59 50.64,156.59
Outline: 42.52,156.59 37.88,156.59
Outline: 42.52,156.59 42.52,150.03 50.64,150.03 50.64,156.59
Outline: 121.08,156.59 121.08,149.93 128.95,149.93 128.95,156.59
Outline: 133.18,156.59 arc-113 131.95,13.69 128.61,19.1 121.79,15.26 124.69,10.3 125.13,9.59 arc-55 46.33,9.49 49.33,15.07 42.51,19.04 39.33,13.59 arc-113 37.88,156.59
Copper layers (1+2*15+16): Top 0.035mm / dielectric 0.3mm / Route2 0.07mm / dielectric 0.7mm / Route15 0.07mm / dielectric 0.3mm / Bottom 0.035mm
Design rules "default *": minimum track width 6mil, minimum drill 0.35mm, track to track 6mil, track to pad 6mil, pad to pad 6mil, via to via 6mil, smd to smd 6mil, copper to edge 40mil, drill to drill 6mil, minimum pad ring 10mil, minimum via ring 8mil, stop-mask expansion 4mil, vias tented up to drill 0mil, thermal gap 10mil
Holes 3.2 mm at 13.66,42.92 65.2,5.12 105.87,5.12 157.41,42.92 29.64,145.78 13.66,125.92 141.42,145.78 157.41,125.92

### Footprints (pad centres in the part's own frame; a part is rotated, then mirrored left to right if it is on the bottom)
C1206 = smd 1.6 x 1.8: 1 -1.4,0; 2 1.4,0
TO220H = drill 1.118 long: 1 -2.54,-10.16; 2 0,-10.16; 3 2.54,-10.16 | hole 3.302: 0,4.826
2X5-SHROUDED_LOCK = drill 1.016 pad 1.88: 1 -1.397,5.08; 2 1.397,5.08; 3 -1.397,2.54; 4 1.397,2.54; 5 -1.397,0; 6 1.397,0; 7 -1.397,-2.54; 8 1.397,-2.54; 9 -1.397,-5.08; 10 1.397,-5.08
XT-60 = drill 4.7 square: BATT 0,4.154; GND 0,11.092
2X20 = drill 1.016 octagon: 1 -24.13,-1.27; 2 -24.13,1.27; 3 -21.59,-1.27; 4 -21.59,1.27; 5 -19.05,-1.27; 6 -19.05,1.27; 7 -16.51,-1.27; 8 -16.51,1.27; 9 -13.97,-1.27; 10 -13.97,1.27; 11 -11.43,-1.27; 12 -11.43,1.27; 13 -8.89,-1.27; 14 -8.89,1.27; 15 -6.35,-1.27; 16 -6.35,1.27; 17 -3.81,-1.27; 18 -3.81,1.27; 19 -1.27,-1.27; 20 -1.27,1.27; 21 1.27,-1.27; 22 1.27,1.27; 23 3.81,-1.27; 24 3.81,1.27; 25 6.35,-1.27; 26 6.35,1.27; 27 8.89,-1.27; 28 8.89,1.27; 29 11.43,-1.27; 30 11.43,1.27; 31 13.97,-1.27; 32 13.97,1.27; 33 16.51,-1.27; 34 16.51,1.27; 35 19.05,-1.27; 36 19.05,1.27; 37 21.59,-1.27; 38 21.59,1.27; 39 24.13,-1.27; 40 24.13,1.27
2X15 = drill 1.016 octagon: 1 -17.78,-1.27; 2 -17.78,1.27; 3 -15.24,-1.27; 4 -15.24,1.27; 5 -12.7,-1.27; 6 -12.7,1.27; 7 -10.16,-1.27; 8 -10.16,1.27; 9 -7.62,-1.27; 10 -7.62,1.27; 11 -5.08,-1.27; 12 -5.08,1.27; 13 -2.54,-1.27; 14 -2.54,1.27; 15 0,-1.27; 16 0,1.27; 17 2.54,-1.27; 18 2.54,1.27; 19 5.08,-1.27; 20 5.08,1.27; 21 7.62,-1.27; 22 7.62,1.27; 23 10.16,-1.27; 24 10.16,1.27; 25 12.7,-1.27; 26 12.7,1.27; 27 15.24,-1.27; 28 15.24,1.27; 29 17.78,-1.27; 30 17.78,1.27
1206 = smd 1.6 x 1.803: A -1.422,0; C 1.422,0
R1206 = smd 1.6 x 1.803: 1 -1.422,0; 2 1.422,0
MA08-1 = drill 1.016 long: 1 -8.89,0; 2 -6.35,0; 3 -3.81,0; 4 -1.27,0; 5 1.27,0; 6 3.81,0; 7 6.35,0; 8 8.89,0
MA10-1 = drill 1.016 long: 1 -11.43,0; 2 -8.89,0; 3 -6.35,0; 4 -3.81,0; 5 -1.27,0; 6 1.27,0; 7 3.81,0; 8 6.35,0; 9 8.89,0; 10 11.43,0
TO228P1042X238-3N = smd 0.889 x 1.219: 1 -2.286,-6.502; 3 2.286,-6.502 | smd 6.731 x 6.502: 2 0,0.152
BUCK = drill 1.016 pad 1.778 octagon: GND 0,0; GNDO 39,0; VIN 0,17.5; VOUT 39,17.5
DA10 = drill 5.08 pad 5.334 long: P$1 0,0; P$2 -7.048,0
22-23-2021 = drill 1 long: 1 -1.27,0; 2 1.27,0

### Placement (x,y rotation side)
C1  120.58,141.33 0 bottom
C2  89.63,66.23 0 top
C3  126.14,141.33 180 bottom
C4  131.26,141.36 0 bottom
C5  115.56,141.33 180 bottom
C6  89.62,61.19 0 top
C7  89.62,56.51 0 top
C8  89.62,51.84 0 top
IC1  128.77,147.28 0 bottom
IC2  118.18,147.29 0 bottom
J1  35.53,85.59 90 bottom
J2  135.53,85.59 90 bottom
J3  45.53,25.59 90 bottom
J4  125.53,25.59 90 bottom
J5  52.14,143.59 270 bottom
JP1  58.36,77.59 270 top
JP2  112.71,77.59 270 top
JP5  74.1,66.26 270 top
JP6  96.96,66.84 270 top
LED1  166.36,83.59 0 top
LED2  166.36,77.59 0 top
LED3  166.36,80.59 0 top
LED4  166.36,86.59 0 top
LED5  166.36,89.59 0 top
LED6  166.36,92.59 0 top
LED7  166.36,95.59 0 top
R1  158.36,83.59 0 top
R2  158.36,77.59 0 top
R3  158.36,80.59 0 top
R4  158.36,86.59 0 top
R5  158.36,89.59 0 top
R6  158.36,92.59 0 top
R7  158.36,95.59 0 top
SV1  35.53,94.59 0 bottom
SV2  45.53,34.59 0 bottom
SV3  135.53,94.59 0 bottom
SV4  125.53,34.59 0 bottom
SV5  85.53,15.59 0 bottom
SV7  35.53,130.59 180 top
SV8  35.53,104.59 180 top
SV9  135.53,70.59 180 top
SV10  135.53,44.59 180 top
SV11  35.53,70.59 180 top
SV12  35.53,44.59 180 top
SV14  85.53,106.59 180 top
SV15  135.53,130.59 180 top
SV16  135.53,104.59 180 top
SV17  85.53,132.59 180 top
SV18  105.83,120.16 90 bottom
U1  96.23,143.92 180 top
U2  87.85,144.07 180 top
U3  79.67,144.18 180 top
U$4  70.53,154.59 180 bottom
U$5  62.29,144.85 90 top
X1  63.31,109.95 180 top

### Tracks (layer width: path | path; a pad name or v marks a point on that pad's centre or on a via)
5V
  Top 0.4: SV17.1 96.03,132.59 100.78,127.84 107.03,127.84 107.78,127.09 107.78,123.34 106.03,121.59 SV18.5 105.78,121.34 51.03,121.34 35.53,105.84 35.53,103.34 34.28,102.09 34.28,94.59 SV1.5 | SV4.5 124.28,34.59 124.28,33.34 130.53,27.09 J4.2 130.28,27.59 145.78,43.09 145.78,81.59 145.91,81.72 | R2.1 150.03,77.59 145.91,81.72 | 145.91,81.72 140.78,86.84 J2.2
  Bottom 0.4: J3.2 50.53,27.09 44.28,33.34 44.28,34.59 SV2.5 44.28,33.09 42.78,33.09 42.28,32.59 41.28,32.59 40.53,33.34 40.53,72.09 29.03,83.59 29.03,87.84 34.28,93.09 SV1.5 34.28,94.59 34.28,93.34 40.53,87.09 J1.2 | 124.91,138.47 126.03,137.34 IC1.3 | 124.91,138.47 124.78,138.59 124.78,141.09 C3.1 | 108.16,121.72 108.03,121.59 106.03,121.59 SV18.5 | 108.16,121.72 124.91,138.47 | 134.91,92.72 140.53,87.09 J2.2 | 134.91,92.72 134.28,93.34 134.28,94.59 SV3.5 | 108.16,121.72 108.28,121.59 108.28,110.34 126.03,92.59 134.78,92.59 134.91,92.72
5V1  (via drill 0.4)
  Top 0.4: v155.53,82.34 156.78,83.59 R1.1 156.53,83.59 156.53,84.59 145.78,95.34 145.78,129.34 144.53,130.59 SV15.1 144.28,130.59 143.28,131.59 143.28,131.84 140.28,134.84 117.78,134.84 115.53,137.09 IC2.3 | v87.63,86.36 82.66,86.36 78.16,90.86 v78.32,91.02 | JP6.2 98.03,84.59 95.78,84.59 JP6.1
  Bottom 0.4: 67.91,87.97 60.03,80.09 54.03,80.09 44.53,70.59 SV11.1 | 67.91,87.97 68.03,88.09 71.44,88.09 74.39,91.04 74.41,91.02 v78.32,91.02 | 63.91,99.22 67.78,95.34 67.78,88.09 67.91,87.97 | 63.91,99.22 53.17,109.95 | 53.17,109.95 44.53,118.59 44.53,130.59 SV7.1 | v155.53,82.34 154.53,82.34 144.53,72.34 144.53,70.59 SV9.1 | 114.28,138.59 114.28,141.09 C5.1 | 114.28,138.59 115.53,137.34 IC2.3 | 63.91,99.22 93.03,128.34 96.28,128.34 106.53,138.59 114.28,138.59 | X1.2 53.17,109.95 | v87.63,86.36 88.05,86.36 88.4,86.71 95.5,86.71 95.53,86.59 95.53,84.84 JP6.1
12V
  Top 1.2: R4.1 156.78,86.59 148.53,94.84 148.53,129.59 141.03,137.09 131.53,137.09 IC1.1 | SV14.9 SV14.10
  Bottom 1.2: IC1.1 132.53,138.34 132.53,141.34 C4.1 132.28,141.84 131.03,143.09 123.53,143.09 122.28,141.84 C1.1 121.78,141.09 121.78,138.34 120.78,137.34 IC2.1 120.53,136.59 120.53,136.09 119.03,134.59 114.78,134.59 112.28,137.09 U$4.VOUT 109.03,136.84 106.28,136.84 76.78,107.34 76.78,106.59 SV14.9
18V  (via drill 0.4, 1.3)
  Top 1.2: v154.78,80.59 R3.1
  other vias: 77.53,146.09 79.53,146.09 81.53,146.09 77.53,144.09 79.53,144.09 81.53,144.09 77.53,142.09 79.53,142.09 81.53,142.09
  pour Route2: -20.32,168.67 -20.32,9.77 16.58,-27.13 151.53,-27.13 207.89,29.23 207.89,122.54 163.22,167.21 161.54,168.89 -20.33,168.89
  pour Top: 72.91,147.92 101.74,147.92 101.74,139.38 72.75,139.38 72.75,147.92
18V1  (via drill 0.4)
  Bottom 1.2: v85.89,146.09 v87.89,146.09 v89.89,146.09
18V2  (via drill 0.4)
  Bottom 1.2: v94.17,146.02 94.28,146.09 96.03,146.09 v96.17,146.02 96.53,146.09 98.03,146.09 v98.17,146.02
18V3  (via drill 0.4)
  Bottom 1.2: 87.78,144.09 86.03,144.09 v85.87,144.02 | 87.78,144.09 v87.87,144.02 | 87.78,144.09 89.78,144.09 v89.87,144.02
18V4  (via drill 0.4)
  Bottom 1.2: 87.78,142.09 86.03,142.09 v85.87,142.15 | 87.78,142.09 v87.87,142.15 | 87.78,142.09 89.78,142.09 v89.87,142.15
18V5  (via drill 0.4)
  Bottom 1.2: v94.26,143.96 94.28,144.09 96.03,144.09 v96.26,143.96 96.78,144.09 98.03,144.09 v98.26,143.96
18V6  (via drill 0.4)
  Bottom 1.2: 96.28,142.09 94.53,142.09 v94.29,142.07 | 96.28,142.09 v96.29,142.07 | 96.28,142.09 98.28,142.09 v98.29,142.07
CHARGE
  Bottom 0.3: SV5.1 94.53,15.59 94.53,35.34 108.78,49.59 108.78,61.84 110.28,63.34 110.28,69.34 111.03,70.09 114.53,70.09 115.78,71.34 115.78,82.09 114.03,83.84 JP2.16
DONE
  Bottom 0.3: SV5.2 91.78,15.59 89.78,13.59 78.78,13.59 78.03,14.34 78.03,21.09 105.78,48.84 105.78,77.34 111.03,82.59 112.78,82.59 113.78,81.59 JP2.18
ESP_EN
  Bottom 0.3: 111.53,71.34 JP2.25
ESP_REC  (via drill 0.4)
  Top 0.3: v155.53,95.59 R7.1 | JP6.16 JP6.15
  Bottom 0.3: v155.53,95.59 154.03,95.59 141.28,82.84 119.28,82.84 114.28,87.84 102.03,87.84 102.03,70.59 98.28,66.84 JP6.16
ESP_RX  (via drill 0.4)
  Top 0.3: v108.78,74.09 108.78,67.59 108.78,64.34 99.53,55.09 99.53,45.59 98.53,44.59 98.6,44.48 | JP5.23 73.03,56.09 75.28,56.09 JP5.24
  Top 0.4: 107.16,67.59 108.78,67.59 | 98.6,44.48 97.99,43.87 95.8,43.87 92.24,47.43 v87,47.43
  Bottom 0.3: v108.78,74.09 109.28,74.09 111.28,76.09 JP2.21 | JP5.23 72.78,56.09 71.53,54.84 71.53,49.84 86.62,49.84 86.86,49.6
  Bottom 0.4: 86.86,49.6 86.86,47.57 v87,47.43
ESP_TRANS  (via drill 0.4)
  Top 0.3: v155.53,92.59 R6.1 | JP6.13 95.78,69.34 98.03,69.34 JP6.14
  Bottom 0.3: v155.53,92.59 151.78,92.59 141.53,82.34 117.28,82.34 114.53,85.09 109.34,85.09 109.03,85.09 | JP6.14 98.03,69.09 97.03,68.09 97.03,65.59 99.03,65.59 103.03,69.59 103.03,79.09 103.04,79.08
  Bottom 0.4: 103.04,79.08 109.05,85.09 109.34,85.09
ESP_TX  (via drill 0.4)
  Top 0.3: v108.78,63.09 108.78,61.84
  Top 0.4: v103.67,54.92 103.67,57.98 v108.78,63.09
  Bottom 0.3: v108.78,63.09 108.78,71.09 111.28,73.59 JP2.23 | JP5.25 73.03,53.59 | 75.53,53.59 JP5.26 | 93.7,53.59 93.78,53.59 94.53,52.84 99.53,52.84 101.28,54.59 101.28,54.78
  Bottom 0.4: 72.94,53.59 73.03,53.59 75.53,53.59 93.7,53.59 | v103.67,54.92 103.53,54.78 101.28,54.78
FPGA_REC  (via drill 0.4)
  Top 0.3: R5.1 155.53,89.59 v151.03,94.09
  Bottom 0.3: v151.03,94.09 149.78,94.09 141.28,85.59 119.03,85.59 114.28,90.34 88.78,90.34 81.28,82.84 72.53,82.84 66.78,77.09 60.53,77.09 60.03,76.59 | 60.03,76.59 59.78,76.34 JP1.22 60.03,76.59
GND  (via drill 0.5)
  Top 0.3: C8.1 88.03,52.09 88.03,56.09 C7.1 88.03,56.59 88.03,61.09 C6.1 88.03,61.59 88.03,66.09 C2.1 88.53,66.59 88.53,74.59 95.53,81.59 JP6.3
  Top 0.5: LED7.C LED6.C LED5.C LED4.C 167.79,86.25 167.96,86.07 167.96,83.41 | LED2.C LED3.C 167.75,80.62 167.75,83.05 167.96,83.26 167.96,83.41 | LED1.C 167.96,83.41
  Bottom 0.3: 128.78,141.34 129.78,141.34 C4.2 | 128.78,141.34 127.78,141.34 C3.2 | 118.03,141.34 119.03,141.34 C1.2 | 118.03,141.34 117.03,141.34 C5.2 | 118.03,141.34 118.03,137.34 IC2.2 | 128.78,141.34 128.78,137.34 IC1.2
  other vias: 167.74,94.11 167.77,91.18 167.71,88.12 167.72,85.11 167.79,82.06 167.75,79.16
  pour Route15: -39.67,184.48 -39.67,-10.98 21.36,-72.01 191,-72.01 246.55,-16.46 246.55,114.01 170.17,190.39 -33.76,190.39
  pour Top: 166.45,96.97 166.45,76.58 169.54,76.58 169.54,96.95 168.47,96.95 166.47,96.95
INPUT
  pour Top: 54.79,141.63 70.3,141.63 70.3,149.36 99.92,149.36 99.92,152.34 74.15,152.34 54.79,152.34
IR1
  Bottom 0.3: SV5.7 79.28,15.59 79.28,21.59 106.28,48.59 106.28,75.34 111.03,80.09 114.53,80.09 115.28,79.34 115.28,75.09 114.03,73.84 JP2.24
IR2
  Top 0.3: SV5.6 81.78,15.59 83.78,13.59 84.78,13.59 85.53,14.34 85.53,27.84 110.28,52.59 110.28,69.34 111.03,70.09 112.78,70.09 113.78,71.09 JP2.26
IR3
  Top 0.3: SV5.5 84.28,15.59 84.28,27.34 109.78,52.84 109.78,82.34 111.28,83.84 JP2.15
KICK  (via drill 0.4)
  Top 0.3: v113.28,59.84 112.78,59.34 112.78,53.09 87.03,27.34 87.03,15.59 SV5.4 | v116.28,59.84 116.28,76.59 114.03,78.84 JP2.20
  Bottom 0.3: v116.28,59.84 v113.28,59.84
KICK_CHIP
  Bottom 0.3: SV5.3 89.53,15.59 89.53,31.09 106.78,48.34 106.78,73.34 111.03,77.59 112.53,77.59 113.78,76.34 JP2.22
M1ACS_OUT  (via drill 0.4)
  Top 0.3: C2.2 91.03,66.09 94.03,66.09 95.53,64.59 JP6.17 96.03,64.59 98.03,64.59 JP6.18 | v65.03,70.09 56.53,70.09 54.03,72.59 40.03,72.59 20.53,92.09 20.53,121.09 26.53,127.09 26.53,130.59 SV7.8
  Bottom 0.3: v65.03,70.09 70.03,65.09 95.03,65.09 95.53,64.59 JP6.17
M1EA
  Bottom 0.3: JP1.4 59.78,99.09 59.78,98.09 60.78,97.09 60.78,88.59 60.03,87.84 43.53,87.84 41.28,85.59 36.78,85.59 35.53,86.84 J1.6
M1EB  (via drill 0.4)
  Top 0.3: v50.78,91.34 37.28,91.34 33.03,87.09 J1.8
  Bottom 0.3: v50.78,91.34 52.28,92.84 57.53,92.84 58.28,93.59 58.28,94.34 59.53,95.59 59.53,96.59 JP1.6
M1H1
  Top 0.3: JP1.8 59.53,94.34 58.53,94.34 57.53,95.34 54.53,95.34 51.03,98.84 43.78,98.84 39.53,94.59 SV1.3
M1H2
  Top 0.3: JP1.10 59.53,91.34 59.53,90.59 58.28,89.34 58.28,88.59 57.53,87.84 56.28,87.84 47.53,96.59 44.03,96.59 42.03,94.59 SV1.2
M1H3
  Bottom 0.3: JP1.12 59.53,89.09 58.78,89.09 57.53,90.34 48.78,90.34 44.53,94.59 SV1.1
M2ACS_OUT
  Top 0.3: JP6.20 98.03,61.84 95.78,61.84 JP6.19 95.53,61.59 91.03,61.59 C6.2
  Bottom 0.3: SV11.8 21.53,70.59 21.53,43.09 39.03,25.59 53.03,25.59 53.03,43.09 72.53,62.59 95.03,62.59 95.53,62.09 JP6.19
M2EA  (via drill 0.4)
  Top 0.3: J2.6 135.53,86.84 134.28,85.59 129.78,85.59 126.78,82.59 113.53,82.59 112.78,83.34 112.78,84.34 112.03,85.09 110.78,85.09 109.03,83.34 95.28,83.34 v89.78,77.84
  Bottom 0.3: v89.78,77.84 71.28,77.84 59.78,66.34 JP1.30
M2EB
  Bottom 0.3: JP1.32 59.53,63.84 59.53,64.59 58.28,65.84 58.28,76.59 59.28,77.59 66.53,77.59 66.53,79.34 72.53,85.34 83.03,85.34 90.53,92.84 124.78,92.84 129.28,88.34 131.53,88.34 132.78,87.09 J2.8
M2H1
  Top 0.3: SV2.3 49.53,34.59 49.53,44.09 58.28,52.84 58.28,59.59 59.53,60.84 JP1.34
M2H2
  Bottom 0.3: SV2.2 52.03,34.59 52.03,46.59 58.28,52.84 58.28,57.09 59.53,58.34 JP1.36
M2H3
  Top 0.3: SV2.1 54.53,34.59 54.53,46.59 60.78,52.84 60.78,54.84 59.78,55.84 JP1.38
M3ACS_OUT  (via drill 0.4)
  Top 0.3: JP6.22 98.03,59.34 95.78,59.34 JP6.21 95.53,59.09 93.03,56.59 91.03,56.59 C7.2 | v90.03,85.59 90.03,90.59 126.53,127.09 126.53,130.59 SV15.8
  Bottom 0.3: v90.03,85.59 90.03,79.09 94.53,74.59 94.53,65.59 96.03,65.59 97.03,64.59 97.03,59.59 96.03,59.59 JP6.21
M3EA
  Top 0.3: JP2.3 111.53,99.09 111.53,98.34 112.78,97.09 112.78,96.34 111.78,95.34 102.03,95.34 102.03,92.59 76.53,67.09 76.53,47.59 75.03,46.09 69.03,46.09 51.28,28.34 46.78,28.34 45.53,27.09 J3.6
M3EB
  Top 0.3: JP2.5 111.28,96.59 102.53,96.59 76.03,70.09 72.53,70.09 61.28,58.84 61.28,39.09 51.03,28.84 44.78,28.84 43.03,27.09 J3.8
M3H1
  Top 0.3: JP2.7 111.53,94.09 111.53,93.09 112.78,91.84 112.78,91.09 113.53,90.34 126.28,90.34 128.03,92.09 136.78,92.09 139.28,94.59 SV3.3
M3H2
  Top 0.3: JP2.9 111.53,91.34 111.53,90.59 112.78,89.34 112.78,88.59 113.53,87.84 127.03,87.84 130.28,91.09 139.03,91.09 141.78,93.84 141.78,94.59 SV3.2
M3H3
  Top 0.3: JP2.11 111.53,88.84 111.53,88.09 112.78,86.84 112.78,86.09 113.53,85.34 126.78,85.34 131.53,90.09 140.53,90.09 144.28,93.84 144.28,94.59 SV3.1
M4ACS_OUT  (via drill 0.4)
  Top 0.3: C8.2 91.03,52.09 95.53,56.59 JP6.23 96.03,56.59 98.03,56.59 JP6.24
  Route15 0.3: v117.53,71.09 116.53,70.09 111.03,70.09 98.03,57.09 JP6.24
  Bottom 0.3: v117.53,71.09 126.03,71.09 126.53,70.59 SV9.8
M4EA
  Top 0.3: JP2.29 111.53,66.09 112.28,66.09 113.53,64.84 114.53,64.84 115.28,64.09 115.28,33.59 120.53,28.34 124.28,28.34 125.53,27.09 J4.6
M4EB
  Bottom 0.3: JP2.31 111.28,63.59 111.28,62.59 109.78,61.09 109.78,49.09 123.03,35.84 123.03,27.09 J4.8
M4H1
  Bottom 0.3: JP2.33 111.53,60.84 111.53,60.09 112.78,58.84 112.78,58.09 113.53,57.34 116.28,57.34 128.03,45.59 128.03,43.34 135.78,35.59 135.78,33.59 134.78,32.59 131.53,32.59 129.53,34.59 SV4.3
M4H2  (via drill 0.4)
  Top 0.3: v123.03,42.59 123.78,42.59 131.78,34.59 SV4.2
  Bottom 0.3: v123.03,42.59 112.78,52.84 112.78,56.34 111.53,57.59 111.53,58.34 JP2.35
M4H3
  Bottom 0.3: JP2.37 111.28,55.84 111.28,55.09 110.28,54.09 110.28,52.84 126.53,36.59 132.28,36.59 134.28,34.59 SV4.1
M11
  Top 0.8: 30.41,129.47 31.53,130.59 SV7.6 | 30.41,129.47 21.53,120.59 21.53,102.84 26.53,97.84 26.53,94.59 SV1.8 | 30.41,129.47 29.28,130.59 SV7.7
M11A
  Bottom 0.3: JP1.3 57.03,99.34 55.53,99.34 47.78,107.09 31.78,107.09 29.28,104.59 SV8.8
M11B
  Bottom 0.3: JP1.5 57.03,96.84 39.53,96.84 31.78,104.59 SV8.7
M12
  Top 0.8: 35.53,129.34 36.78,130.59 SV7.4 | 35.53,129.34 22.53,116.34 22.53,103.34 29.03,96.84 29.03,94.59 SV1.7 | 35.53,129.34 34.28,130.59 SV7.5
M12A
  Bottom 0.3: JP1.7 57.28,94.34 57.28,95.09 58.28,96.09 58.28,97.09 57.53,97.84 56.28,97.84 47.53,106.59 36.28,106.59 34.28,104.59 SV8.6
M12B  (via drill 0.4)
  Top 0.3: v50.78,97.84 57.03,91.59 JP1.9
  Bottom 0.3: v50.78,97.84 43.53,97.84 36.78,104.59 SV8.5
M13
  Bottom 0.8: SV1.6 31.53,94.59 31.53,95.09 24.28,102.34 23.53,102.34 22.53,103.34 22.53,113.59 39.53,130.59 SV7.3 SV7.2
M13A
  Top 0.3: JP1.11 57.28,89.09 57.28,90.09 58.28,91.09 58.28,91.84 59.28,92.84 60.03,92.84 60.78,93.59 60.78,99.84 60.03,100.59 43.53,100.59 39.53,104.59 SV8.4
M13B
  Top 0.3: SV8.3 41.78,104.59 39.78,106.59 38.78,106.59 38.03,105.84 38.03,93.34 39.03,92.34 51.03,92.34 57.03,86.34 JP1.13
M21
  Top 0.8: SV11.6 SV11.7 29.28,70.34 22.53,63.59 22.53,43.34 31.28,34.59 SV2.8
M21A
  Top 0.3: SV12.8 29.28,44.59 53.28,68.59 57.03,68.59 JP1.27
M21B
  Top 0.3: SV12.7 31.78,44.59 53.28,66.09 57.03,66.09 JP1.29
M22
  Top 0.8: SV11.4 SV11.5
  Bottom 0.8: SV2.7 39.03,34.59 39.03,35.09 31.78,42.34 23.53,42.34 22.53,43.34 22.53,56.34 36.78,70.59 SV11.4
M22A
  Top 0.3: SV12.6 34.28,44.59 53.28,63.59 57.03,63.59 JP1.31
M22B
  Top 0.3: SV12.5 37.03,44.59 38.03,45.59 38.03,45.84 53.03,60.84 57.03,60.84 JP1.33
M23
  Top 0.8: SV11.2 SV11.3
  Bottom 0.8: SV2.6 41.78,34.59 41.78,36.59 48.53,43.34 48.53,63.59 42.03,70.09 42.03,70.59 SV11.2
M23A
  Top 0.3: SV12.4 39.53,44.59 53.28,58.34 57.03,58.34 JP1.35
M23B
  Top 0.3: SV12.3 42.03,44.59 53.28,55.84 57.03,55.84 JP1.37
M31
  Top 0.8: 130.41,129.47 131.53,130.59 SV15.6 | 130.41,129.47 122.53,121.59 122.53,103.34 126.53,99.34 126.53,94.59 SV3.8 | 130.41,129.47 129.28,130.59 SV15.7
M31A  (via drill 0.4)
  Top 0.3: v120.78,106.59 114.03,99.84 114.03,99.34 JP2.4
  Bottom 0.3: v120.78,106.59 127.03,106.59 129.03,104.59 SV16.8
M31B  (via drill 0.4)
  Top 0.3: v121.28,107.59 121.78,107.09 121.78,105.34 114.03,97.59 114.03,96.84 JP2.6
  Bottom 0.3: v121.28,107.59 128.53,107.59 131.53,104.59 SV16.7
M32
  Bottom 0.8: 135.53,129.34 136.78,130.59 SV15.4 | 135.53,129.34 119.53,113.34 119.53,106.34 129.03,96.84 129.03,94.59 SV3.7 | 135.53,129.34 134.28,130.59 SV15.5
M32A
  Top 0.3: JP2.8 114.03,94.09 124.78,94.09 126.28,92.59 127.03,92.59 128.03,93.59 128.03,98.34 134.28,104.59 SV16.6
M32B
  Top 0.3: JP2.10 114.03,91.59 126.78,91.59 127.78,92.59 134.78,92.59 135.53,93.34 135.53,103.34 136.78,104.59 SV16.5
M33
  Bottom 0.8: 140.66,129.47 139.53,130.59 SV15.3 | 140.66,129.47 148.53,121.59 148.53,103.34 147.53,102.34 139.28,102.34 132.78,95.84 132.78,95.59 131.78,94.59 SV3.6 | 140.66,129.47 141.78,130.59 SV15.2
M33A
  Top 0.3: JP2.12 114.03,89.09 125.78,89.09 128.28,91.59 138.78,91.59 140.53,93.34 140.53,103.59 139.53,104.59 SV16.4
M33B
  Top 0.3: JP2.14 114.03,86.59 126.53,86.59 130.53,90.59 140.28,90.59 143.03,93.34 143.03,103.59 142.03,104.59 SV16.3
M41
  Top 0.8: 130.41,69.47 131.53,70.59 SV9.6 | 130.41,69.47 116.78,55.84 116.78,34.59 SV4.8 | 130.41,69.47 129.28,70.59 SV9.7
M41A
  Bottom 0.3: SV10.8 129.28,44.59 131.28,42.59 134.78,42.59 135.53,43.34 135.53,47.09 114.03,68.59 JP2.28
M41B  (via drill 0.4)
  Top 0.3: v131.78,48.34 131.78,44.59 SV10.7
  Bottom 0.3: v131.78,48.34 114.03,66.09 JP2.30
M42
  Top 0.8: 135.53,69.34 136.78,70.59 SV9.4 | 135.53,69.34 119.28,53.09 119.28,34.59 SV4.7 | 135.53,69.34 134.28,70.59 SV9.5
M42A
  Bottom 0.3: JP2.32 114.03,63.59 115.28,63.59 134.28,44.59 SV10.6
M42B  (via drill 0.4)
  Top 0.3: v125.53,52.09 129.28,52.09 136.78,44.59 SV10.5
  Bottom 0.3: v125.53,52.09 125.53,52.34 117.03,60.84 114.03,60.84 JP2.34
M43
  Top 0.8: SV4.6 121.78,34.59 121.78,52.84 139.53,70.59 SV9.3 SV9.2
M43A  (via drill 0.4)
  Top 0.3: v123.53,53.09 130.78,53.09 139.28,44.59 SV10.4
  Bottom 0.3: v123.53,53.09 118.28,58.34 114.03,58.34 JP2.36
M43B  (via drill 0.4)
  Top 0.3: v123.03,46.84 129.28,46.84 130.53,45.59 130.53,43.34 131.28,42.59 139.78,42.59 141.78,44.59 SV10.3
  Bottom 0.3: v123.03,46.84 114.03,55.84 JP2.38
MD1
  Top 0.8: SV17.7 SV17.6 81.78,132.84 83.78,134.84 95.03,134.84 100.78,129.09 105.78,129.09 SV18.8
MD1A
  Top 0.3: JP1.15 57.28,84.09 58.03,84.09 59.28,85.34 60.28,85.34 79.03,104.09 79.03,106.59 SV14.8
MD1B
  Top 0.3: JP1.17 57.28,81.59 58.03,81.59 59.03,82.59 60.03,82.59 81.53,104.09 81.53,106.59 SV14.7
MD2  (via drill 1)
  Top 0.8: SV17.5 SV17.4 86.78,132.34 94.28,124.84 v96.53,124.84
  Bottom 0.8: v96.53,124.84 98.03,126.34 105.78,126.34 SV18.7
MD2A
  Top 0.3: JP1.19 57.28,79.09 58.03,79.09 59.03,80.09 60.03,80.09 63.53,83.59 63.53,85.34 84.03,105.84 84.03,106.59 SV14.6
MD2B
  Top 0.3: JP1.21 57.28,76.34 58.03,76.34 59.28,77.59 60.03,77.59 64.03,81.59 64.03,83.84 86.78,106.59 SV14.5
MD3
  Top 0.8: SV17.2 91.03,132.59 | 91.03,132.59 SV17.3 | SV18.6 105.78,124.09 99.28,124.09 91.03,132.34 91.03,132.59
MD3A
  Top 0.3: JP1.23 57.28,73.84 58.03,73.84 59.28,75.09 60.03,75.09 61.78,76.84 61.78,78.59 64.53,81.34 64.53,83.59 85.53,104.59 87.28,104.59 89.28,106.59 SV14.4
MD3B
  Top 0.3: JP1.25 57.28,71.34 58.03,71.34 59.28,72.59 60.03,72.59 62.28,74.84 62.28,78.34 65.03,81.09 65.03,83.34 85.28,103.59 88.78,103.59 91.78,106.59 SV14.3
MDH1
  Top 0.3: JP1.16 59.78,84.09 80.53,104.84 80.53,107.84 85.28,112.59 107.03,112.59 107.78,113.34 107.78,114.59 106.03,116.34 SV18.3
MDH2  (via drill 0.4)
  Top 0.3: v62.28,89.84 78.03,105.59 78.03,107.84 83.78,113.59 105.78,113.59 SV18.2
  Bottom 0.3: v62.28,89.84 62.28,84.84 59.78,82.34 59.78,81.59 JP1.18
MDH3
  Bottom 0.3: JP1.20 59.78,79.09 65.46,79.09 73.46,87.09 81.78,87.09 105.78,111.09 SV18.1
N$1
  Top 0.3: JP5.1 73.03,84.09 75.28,84.09 JP5.2
N$4
  Top 0.5: LED1.A R1.2
N$6
  Top 0.3: JP5.5 73.03,79.09 75.28,79.09 JP5.6
N$7
  Top 0.5: R2.2 LED2.A
N$8
  Top 0.3: JP5.7 73.03,76.34 75.28,76.34 JP5.8
N$9
  Top 0.3: JP5.9 73.03,73.84 75.28,73.84 JP5.10
N$10
  Top 0.5: LED3.A R3.2
N$11
  Top 0.3: JP5.12 JP5.11
N$12
  Top 0.3: JP5.13 73.03,68.84 75.28,68.84 JP5.14
N$13
  Top 0.5: R4.2 LED4.A
N$14
  Top 0.3: JP5.15 73.03,66.34 75.28,66.34 JP5.16
N$15
  Top 0.3: JP5.17 73.03,63.84 75.28,63.84 JP5.18
N$16
  Top 0.5: LED5.A R5.2
N$17
  Top 0.3: JP5.19 73.03,61.09 75.28,61.09 JP5.20
N$18
  Top 0.3: JP5.21 73.03,58.59 75.28,58.59 JP5.22
N$19
  Top 0.5: R6.2 LED6.A
N$22
  Top 0.5: R7.2 LED7.A
N$23
  Top 0.3: JP5.27 73.03,51.09 75.28,51.09 JP5.28
N$24
  Top 0.3: JP5.29 73.03,48.59 75.28,48.59 JP5.30
N$27
  Top 0.3: JP6.5 95.78,79.59 98.03,79.59 JP6.6
N$28
  Top 0.3: JP6.7 95.78,77.09 98.03,77.09 JP6.8
N$29
  Top 0.3: JP6.9 95.78,74.59 98.03,74.59 JP6.10
N$30
  Top 0.3: JP6.11 95.78,71.84 98.03,71.84 JP6.12
N$38
  Top 0.3: JP6.27 95.78,51.59 98.03,51.59 JP6.28
N$39
  Top 0.3: JP6.29 95.78,49.09 98.03,49.09 JP6.30
N$41
  Top 0.3: JP6.25 96.03,54.09 98.03,54.09 JP6.26
SUPP
  Top 5: J5.BATT 47.99,141.56 51.59,137.96 61.75,137.96 61.84,138.05 62.09,137.8 U$5.P$2
  pour Top: 44.79,149.23 44.79,132.87 68.4,132.87 68.4,140.85 51.92,140.85 51.92,149.23